# Altium project Bluetooth_Speaker_Driver.PrjPcb (part 1 of 2)
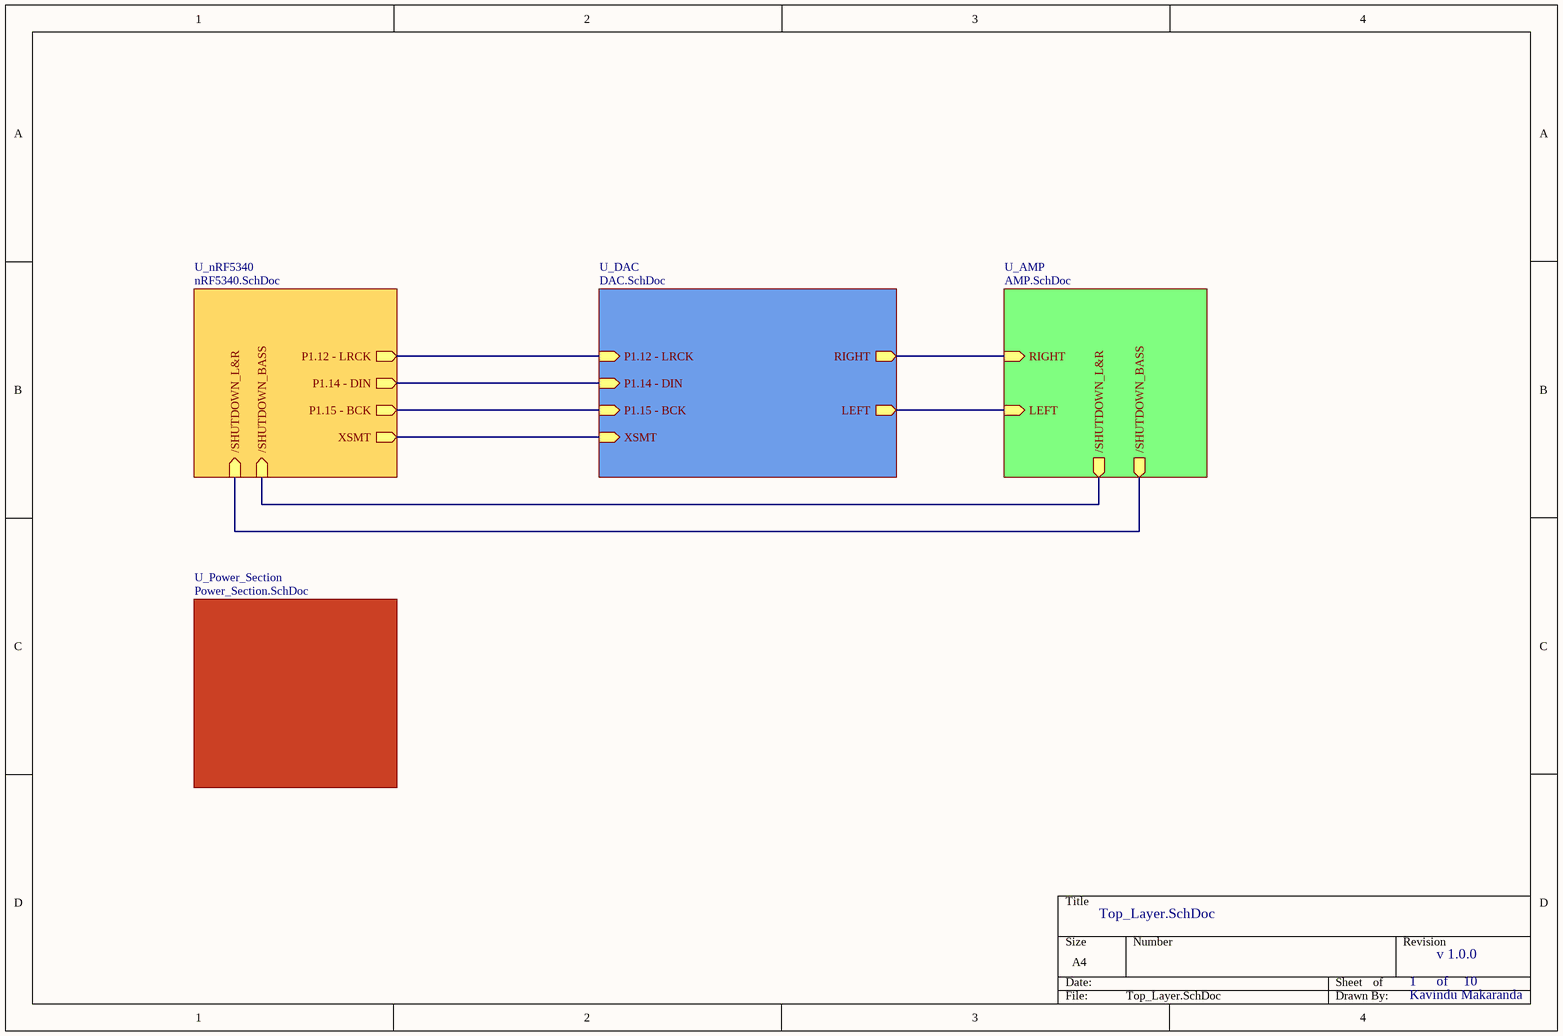
[diagram p0: Top_Layer.SchDoc]
Engineer: Kavindu Makaranda
10 sheets, 229 parts. Net scope: hierarchical (ports join the sheet entries above them; power ports are global).
Board file: PCB.PcbDoc
Sheets:
  Top_Layer.SchDoc
    U_nRF5340 = nRF5340.SchDoc
      U_LED_Indicator_? = LED_Indicator.SchDoc
      U_LED_Indicator_? = LED_Indicator.SchDoc
      U_LED_Indicator_? = LED_Indicator.SchDoc
      U_LED_Indicator_? = LED_Indicator.SchDoc
    U_Power_Section = Power_Section.SchDoc
      U_5v negative and positive channels = 5v negative and positive channels.SchDoc
    U_AMP = AMP.SchDoc
      U_Power_amp_Stereo_L&R = Stereo_L&R_TPA3138D2.SchDoc
      U_Power_amp_Bass = Mono_Bass_TPA3138D2.SchDoc
      U_LOW_PASS_FILTER = 4th_Order_Linwitz-Riley_Low_Pass_Filter.SchDoc
    U_DAC = DAC.SchDoc

## Sheet Top_Layer.SchDoc
size A4; SheetNumber: 1; SheetTotal: 10

### Sub-sheets
U_AMP = AMP.SchDoc: RIGHT (in), LEFT (in), /SHUTDOWN_L&R (out), /SHUTDOWN_BASS (out)
U_DAC = DAC.SchDoc: P1.15 - BCK (in), P1.14 - DIN (in), P1.12 - LRCK (in), LEFT (out), RIGHT (out), XSMT (in)
U_nRF5340 = nRF5340.SchDoc: P1.12 - LRCK (out), P1.14 - DIN (out), P1.15 - BCK (out), XSMT (out), /SHUTDOWN_L&R (in), /SHUTDOWN_BASS (in)
U_Power_Section = Power_Section.SchDoc: no entries

### Nets
P0.00 / XL1: sheet U_nRF5340/P1.12 - LRCK, sheet U_DAC/P1.12 - LRCK
P0.01 / XL2: sheet U_nRF5340/P1.15 - BCK, sheet U_DAC/P1.15 - BCK
P0.04 / AIN0: sheet U_nRF5340//SHUTDOWN_BASS, sheet U_AMP//SHUTDOWN_L&R
P0.05 / AIN1: sheet U_nRF5340//SHUTDOWN_L&R, sheet U_AMP//SHUTDOWN_BASS
P1.00: sheet U_nRF5340/XSMT, sheet U_DAC/XSMT
P1.01: sheet U_nRF5340/P1.14 - DIN, sheet U_DAC/P1.14 - DIN
NetC22_2: sheet U_AMP/RIGHT, sheet U_DAC/RIGHT
NetC29_2: sheet U_AMP/LEFT, sheet U_DAC/LEFT

### Notes on the sheet
- v 1.0.0
- of

## Sheet nRF5340.SchDoc
size A4; SheetNumber: 2; SheetTotal: 10
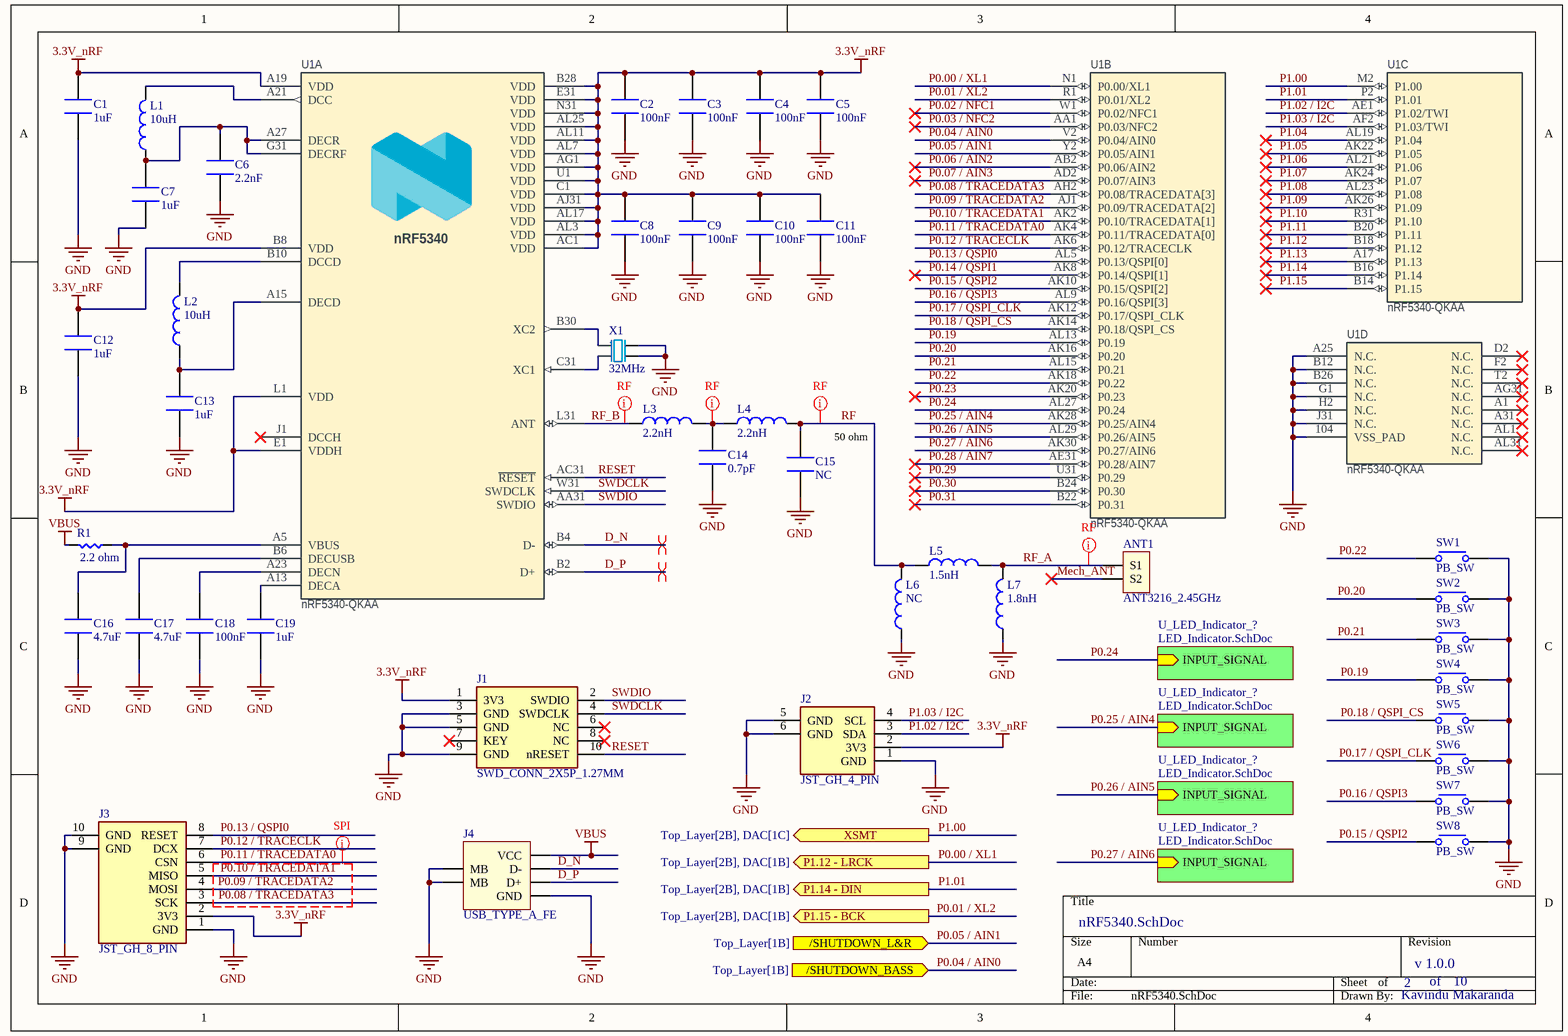
[diagram p1: nRF5340.SchDoc]

### Parts
ANT1  ANT3216_2.45GHz  [ANT3216_2.4GHz]
C1  1uF  [CAPC0402X06N]
C2  100nF  [CAPC0201X03N]
C3  100nF  [CAPC0201X03N]
C4  100nF  [CAPC0201X03N]
C5  100nF  [CAPC0201X03N]
C6  2.2nF  [CAPC0201X03N]
C7  1uF  [CAPC0402X06N]
C8  100nF  [CAPC0201X03N]
C9  100nF  [CAPC0201X03N]
C10  100nF  [CAPC0201X03N]
C11  100nF  [CAPC0201X03N]
C12  1uF  [CAPC0402X06N]
C13  1uF  [CAPC0402X06N]
C14  0.7pF  [CAPC0201X03N]
C15  NC  [CAPC0201X03N]
C16  4.7uF  [CAP0805X13N]
C17  4.7uF  [CAP0805X13N]
C18  100nF  [CAPC0201X03N]
C19  1uF  [CAPC0402X06N]
J1  SWD_CONN_2X5P_1.27MM  [CONN_2X5P_1.27MM - duplicate]
J2  JST_GH_4_PIN  [JST_GH_4_PIN]
J3  JST_GH_8_PIN  [JST_GH_8_PIN]
J4  USB_TYPE_A_FE  [USB_TYPE_A_FE]
L1  10uH  [INDC0603X08N]
L2  10uH  [INDC0603X08N]
L3  2.2nH  [INDC0201]
L4  2.2nH  [INDC0201]
L5  1.5nH  [INDC0201]
L6  NC  [INDC0201]  (no BOM)
L7  1.8nH  [INDC0201]
R1  2.2 ohm  [CAPC0201X03N]
SW1  PB_SW  [SW_PB_2]
SW2  PB_SW  [SW_PB_2]
SW3  PB_SW  [SW_PB_2]
SW4  PB_SW  [SW_PB_2]
SW5  PB_SW  [SW_PB_2]
SW6  PB_SW  [SW_PB_2]
SW7  PB_SW  [SW_PB_2]
SW8  PB_SW  [SW_PB_2]
U1  nRF5340-QKAA  [AQFN40P700X700X85_HS-99N]  (parts A,B,C,D of 4)
X1  32MHz  [CRYOSC_3.2X2.5M]

### Sub-sheets
U_LED_Indicator_? = LED_Indicator.SchDoc: INPUT_SIGNAL (in)
U_LED_Indicator_? = LED_Indicator.SchDoc: INPUT_SIGNAL (in)
U_LED_Indicator_? = LED_Indicator.SchDoc: INPUT_SIGNAL (in)
U_LED_Indicator_? = LED_Indicator.SchDoc: INPUT_SIGNAL (in)

### Ports
/SHUTDOWN_BASS (in, see Top_Layer[1B]), /SHUTDOWN_L&R (in, see Top_Layer[1B]), P1.12 - LRCK (out, see Top_Layer[2B], DAC[1B]), P1.14 - DIN (out, see Top_Layer[2B], DAC[1B]), P1.15 - BCK (out, see Top_Layer[2B], DAC[1B]), XSMT (out, see Top_Layer[2B], DAC[1C])

### Nets
3.3V_nRF: C1.2 C2.2 C3.2 C4.2 C5.2 C8.2 C9.2 C10.2 C11.2 C12.2 J1.1(3V3) J2.2(3V3) J3.2(3V3) U1.A19(VDD) U1.AC1(VDD) U1.AG1(VDD) U1.AJ31(VDD) U1.AL3(VDD) U1.AL7(VDD) U1.AL11(VDD) U1.AL17(VDD) U1.AL25(VDD) U1.B8(VDD) U1.B28(VDD) U1.C1(VDD) U1.E1(VDDH) U1.E31(VDD) U1.L1(VDD) U1.N31(VDD) U1.U1(VDD)
GND: C1.1 C2.1 C3.1 C4.1 C5.1 C6.1 C7.1 C8.1 C9.1 C10.1 C11.1 C12.1 C13.1 C14.2 C15.2 C16.1 C17.1 C18.1 C19.1 J1.3(GND) J1.5(GND) J1.9(GND) J2.1(GND) J2.5(GND) J2.6(GND) J3.1(GND) J3.9(GND) J3.10(GND) J4.4(GND) J4.5(MB) J4.6(MB) L6.1 L7.1 SW1.2 SW2.2 SW3.2 SW4.2 SW5.2 SW6.2 SW7.2 SW8.2 U1.104(VSS_PAD) U1.A25(N.C.) U1.B12(N.C.) U1.B26(N.C.) U1.G1(N.C.) U1.H2(N.C.) U1.J31(N.C.) X1.2(GND1) X1.4(GND2)
VBUS: J4.1(VCC) R1.2
D_N: J4.2(D-) U1.B4(D-)
D_P: J4.3(D+) U1.B2(D+)
Mech_ANT: ANT1.2(S2)
P0.00 / XL1: U1.N1(P0.00/XL1) ; port P1.12 - LRCK
P0.01 / XL2: U1.R1(P0.01/XL2) ; port P1.15 - BCK
P0.02 / NFC1: U1.W1(P0.02/NFC1)
P0.03 / NFC2: U1.AA1(P0.03/NFC2)
P0.04 / AIN0: U1.V2(P0.04/AIN0) ; port /SHUTDOWN_BASS
P0.05 / AIN1: U1.Y2(P0.05/AIN1) ; port /SHUTDOWN_L&R
P0.06 / AIN2: U1.AB2(P0.06/AIN2)
P0.07 / AIN3: U1.AD2(P0.07/AIN3)
P0.08 / TRACEDATA3: J3.3(SCK) U1.AH2(P0.08/TRACEDATA[3])
P0.09 / TRACEDATA2: J3.4(MOSI) U1.AJ1(P0.09/TRACEDATA[2])
P0.10 / TRACEDATA1: J3.5(MISO) U1.AK2(P0.10/TRACEDATA[1])
P0.11 / TRACEDATA0: J3.6(CSN) U1.AK4(P0.11/TRACEDATA[0])
P0.12 / TRACECLK: J3.7(DCX) U1.AK6(P0.12/TRACECLK)
P0.13 / QSPI0: J3.8(RESET) U1.AL5(P0.13/QSPI[0])
P0.14 / QSPI1: U1.AK8(P0.14/QSPI[1])
P0.15 / QSPI2: SW8.1 U1.AK10(P0.15/QSPI[2])
P0.16 / QSPI3: SW7.1 U1.AL9(P0.16/QSPI[3])
P0.17 / QSPI_CLK: SW6.1 U1.AK12(P0.17/QSPI_CLK)
P0.18 / QSPI_CS: SW5.1 U1.AK14(P0.18/QSPI_CS)
P0.19: SW4.1 U1.AL13(P0.19)
P0.20: SW2.1 U1.AK16(P0.20)
P0.21: SW3.1 U1.AL15(P0.21)
P0.22: SW1.1 U1.AK18(P0.22)
P0.23: U1.AK20(P0.23)
P0.24: U1.AL27(P0.24) ; sheet U_LED_Indicator_?/INPUT_SIGNAL
P0.25 / AIN4: U1.AK28(P0.25/AIN4) ; sheet U_LED_Indicator_?/INPUT_SIGNAL
P0.26 / AIN5: U1.AL29(P0.26/AIN5) ; sheet U_LED_Indicator_?/INPUT_SIGNAL
P0.27 / AIN6: U1.AK30(P0.27/AIN6) ; sheet U_LED_Indicator_?/INPUT_SIGNAL
P0.28 / AIN7: U1.AE31(P0.28/AIN7)
P0.29: U1.U31(P0.29)
P0.30: U1.B24(P0.30)
P0.31: U1.B22(P0.31)
P1.00: U1.M2(P1.00) ; port XSMT
P1.01: U1.P2(P1.01) ; port P1.14 - DIN
P1.02 / I2C: J2.3(SDA) U1.AE1(P1.02/TWI)
P1.03 / I2C: J2.4(SCL) U1.AF2(P1.03/TWI)
P1.04: U1.AL19(P1.04)
P1.05: U1.AK22(P1.05)
P1.06: U1.AL21(P1.06)
P1.07: U1.AK24(P1.07)
P1.08: U1.AL23(P1.08)
P1.09: U1.AK26(P1.09)
P1.10: U1.R31(P1.10)
P1.11: U1.B20(P1.11)
P1.12: U1.B18(P1.12)
P1.13: U1.A17(P1.13)
P1.14: U1.B16(P1.14)
P1.15: U1.B14(P1.15)
RESET: J1.10(nRESET) U1.AC31(~{RESET})
RF: C15.1 L4.2 L5.1 L6.2
RF_A: ANT1.1(S1) L5.2 L7.2
RF_B: L3.1 U1.L31(ANT)
SWDCLK: J1.4(SWDCLK) U1.W31(SWDCLK)
SWDIO: J1.2(SWDIO) U1.AA31(SWDIO)
NetC6_2: C6.2 C7.2 L1.1 U1.A27(DECR) U1.G31(DECRF)
NetC13_2: C13.2 L2.1 U1.A15(DECD)
NetC14_1: C14.1 L3.2 L4.1
NetC16_2: C16.2 R1.1 U1.A5(VBUS)
NetC17_2: C17.2 U1.B6(DECUSB)
NetC18_2: C18.2 U1.A23(DECN)
NetC19_2: C19.2 U1.A13(DECA)
NetL1_2: L1.2 U1.A21(DCC)
NetL2_2: L2.2 U1.B10(DCCD)
NetU1_B30: U1.B30(XC2) X1.1(CLK1)
NetU1_C31: U1.C31(XC1) X1.3(CLK2)

Not connected (* = marked no-connect by the designer): J1 6(NC)* 7(KEY)* 8(NC)*; U1 A1(N.C.)* A31(N.C.)* AG31(N.C.)* AL1(N.C.)* AL31(N.C.)* D2(N.C.)* F2(N.C.)* J1(DCCH)* T2(N.C.)*

### Layout directives
differential pair: D_N, D_P
net class RF: NetC14_1, RF, RF_A, RF_B
net class SPI: P0.08 / TRACEDATA3, P0.09 / TRACEDATA2, P0.10 / TRACEDATA1

### Notes on the sheet
- 50 ohm
- v 1.0.0
- of
- (in symbol nRF5340-QKAA, part A) nRF5340

### Library data of the parts
ANT1 = ANT3216_2.45GHz: C293767, ANT3216LL00R2400A, -40℃~+105℃ 1.2mm 1.6mm 160MHz 1W 2.45GHz 3.2mm 5.05dBi 50Ω 1206 Antennas ROHS; Supplier 1: Verical; Supplier Part Number 1: ANT3216LL00R2400A
C1 C7 C12 C13 C19 = CC0402_1uF_X7R: C307427, CL05B105KQ5NQNC, 1uF 6.3V X7R ±10% 0402 Multilayer Ceramic Capacitors MLCC - SMD/SMT ROHS; Supplier 1: element14 APAC; Supplier Part Number 1: CL05B105KQ5NQNC
C2-C5 C8-C11 C18 = CC0201_100nF_X7R: C1882920, CC0201KRX7R5BB104, 100nF 6.3V X7R ±10% 0201 Multilayer Ceramic Capacitors MLCC - SMD/SMT ROHS; Supplier 1: element14 APAC; Supplier Part Number 1: CC0201KRX7R5BB104
C6 = CC0201_2.2nF_X7R: C161488. GRM033R71E222KA12D, 2.2nF 25V X7R ±10% 0201 Multilayer Ceramic Capacitors MLCC - SMD/SMT ROHS; Supplier 1: element14 APAC; Supplier Part Number 1: GRM033R71E222KA12D
C14 C15 = CC0201_0.7pF_COG: C907945, GJM0335C1ER70WB01D, 0.7pF 25V C0G 0201 Multilayer Ceramic Capacitors MLCC - SMD/SMT ROHS; Supplier 1: element14 APAC; Supplier Part Number 1: GJM0335C1ER70WB01D
C16 C17 = CC0805_4.7uF_X7R: C354262, CC0805KKX7R8BB475, 25V 4.7uF X7R ±10% 0805 Multilayer Ceramic Capacitors MLCC - SMD/SMT ROHS; Supplier 1: element14 APAC; Supplier Part Number 1: CC0805KKX7R8BB475
J1 = SWD_CONN_2X5P_1.27MM: C42372547, HX JN1.27-2x5P ZZ H4.9, -40℃~+105℃ 1.27mm 1.27mm 1A 2 2x5P 5 500V Black Copper Gold IDC Header Through Hole Plugin,P=1.27mm IDC Connectors ROHS; Supplier 1: Verical; Supplier Part Number 1: 3220-10-0100-00
J2 = JST_GH_4_PIN: C161692, BM04B-GHS-TBT(LF)(SN), -25℃~+85℃ 1 1.25mm 1A 1x4P 4 4.05mm 4.32mm 4P 50V 8.25mm Auxiliary Solder Pin GH PA9T Phosphor bronze Surface Mount,Vertical Tin UL94V-0 White SMD,P=1.25mm Wire To Board Connector ROHS; Supplier 1: CoreStaff; Supplier Part Number 1: ST74986991
J3 = JST_GH_8_PIN: C133062, BM08B-GHS-TBT(LF)(SN), -25℃~+85℃ 1 1.25mm 13.25mm 1A 1x8P 4.05mm 4.32mm 50V 8 8P Auxiliary Solder Pin GH PA9T Phosphor bronze Surface Mount,Vertical Tin UL94V-0 White SMD,P=1.25mm Wire To Board Connector ROHS; Supplier 1: Future Electronics; Supplier Part Number 1: BM08B-GHS-TBT(LF)(SN)
J4 = USB_TYPE_A_FE: C456018, AF 90 WJDG, -25℃~+85℃ 1 1.5A 14mm 30V 4P 5,000 times Female Right Angle Type-A USB 2.0 White 弯插 USB Connectors ROHS; Supplier 1: UnikeyIC; Supplier Part Number 1: AF 90 WJDG
L1 L2 = IN0603_10uH: C76798, MLZ1608M100WT000, 1.05Ω 10uH 250mA 2MHz 90mA Multilayer inductor ±20% 0603 Inductors (SMD) ROHS; Supplier 1: element14 APAC; Supplier Part Number 1: MLZ1608M100WT000
L3 L4 = IN0201_2.2nH: C98041, LQP03TN2N2B02D, 11GHz 14@500MHz 150mΩ 2.2nH 600mA Thick Film Inductor 0201 Inductors (SMD) ROHS; Supplier 1: element14 APAC; Supplier Part Number 1: LQP03TN2N2B02D
L5 = IN0201_1.5nH: C77114, LQP03TN1N5B02D, 1.5nH 14@500MHz 150mΩ 15GHz 600mA Thick Film Inductor 0201 Inductors (SMD) ROHS; Supplier 1: Future Electronics; Supplier Part Number 1: LQP03TN1N5B02D
L6 L7 = IN0201_1.8nH: C98040, LQP03TN1N8B02D, 1.8nH 14@500MHz 150mΩ 15GHz 600mA Thick Film Inductor 0201 Inductors (SMD) ROHS; Supplier 1: element14 APAC; Supplier Part Number 1: LQP03TN1N8B02D
R1 = REC0201_2.2_THICK: C474415, RC0201JR-072R2L, -100ppm/℃~+350ppm/℃ -55℃~+125℃ 2.2Ω 25V 50mW Thick Film Resistor ±5% 0201 Chip Resistor - Surface Mount ROHS; Supplier 1: element14 APAC; Supplier Part Number 1: RC0201JR-072R2L
SW1-SW8 = SW_SMD_PUSH: C49393629, R4A25211L, 1.8N 12V 50mA Gull Wing Rectangular Button SPST-NO Surface Mount,Vertical White SMD Pushbutton Switches ROHS
U1 = nRF5340-QKAA: Multi-protocol Bluetooth Low Energy, IEEE 802.15.4, ANT and 2.4GHz proprietary system-on-chip; Pad Count: 98; Footprint Doc: AQFN-98; Value: nRF5340-QKAA; Component Class: nRF_Devices; Supplier 1: DigiKey; Supplier Part Number 1: 4823-NRF5340-QKAA-RCT-ND; Supplier 2: DigiKey; Supplier Part Number 2: 4823-NRF5340-QKAA-R7CT-ND
X1 = SMD3225_4P_32MHz_OSC: C20617581, XL2MI-111-32M, -40℃~+85℃ 10pF 32MHz 40Ω Crystal Oscillator ±10ppm ±20ppm SMD3225-4P Crystals ROHS; Supplier 1: UnikeyIC; Supplier Part Number 1: XL2MI-111-32M

## Sheet LED_Indicator.SchDoc
size A4; SheetNumber: 3; SheetTotal: 10
Used 4 times, as channels U_nRF5340/U_LED_Indicator_?, U_nRF5340/U_LED_Indicator_?, U_nRF5340/U_LED_Indicator_?, U_nRF5340/U_LED_Indicator_?. Parts and nets are listed once, with the designators drawn on the sheet.
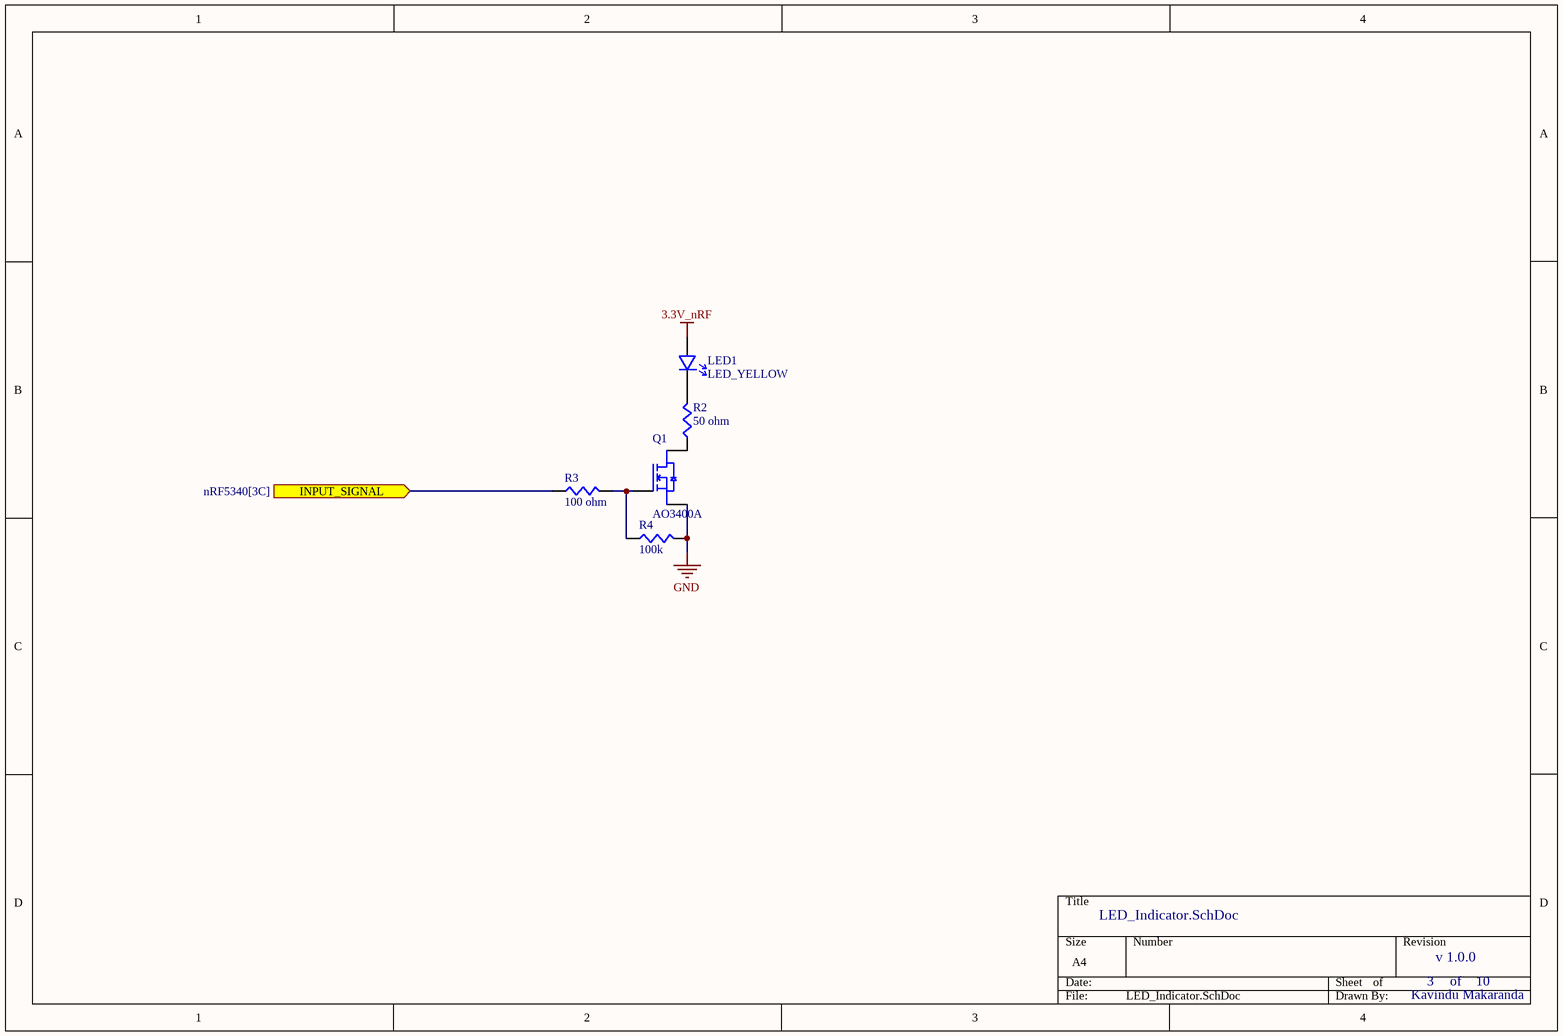
[diagram p2: LED_Indicator.SchDoc]

### Parts
LED1  LED_YELLOW  [LED_0805_127P120X200-2N]
Q1  AO3400A  [SOT23_P240X110-3N]
R2  50 ohm  [RECS0603X45N]
R3  100 ohm  [RECS0603X45N]
R4  100k  [RECS0603X45N]

### Ports
INPUT_SIGNAL (in, see nRF5340[3C])

### Nets
3.3V_nRF: LED1.2(+)
GND: Q1.2(SOURCE) R4.2
INPUT_SIGNAL: R3.1 ; port INPUT_SIGNAL
NetLED1_1: LED1.1(-) R2.2
NetQ1_1: Q1.1(GATE) R3.2 R4.1
NetQ1_3: Q1.3(DRAIN) R2.1

### Channels
U_nRF5340/U_LED_Indicator_?: designators end in D; ports INPUT_SIGNAL=P0.24
U_nRF5340/U_LED_Indicator_?: designators end in C; ports INPUT_SIGNAL=P0.26 / AIN5
U_nRF5340/U_LED_Indicator_?: designators end in B; ports INPUT_SIGNAL=P0.25 / AIN4
U_nRF5340/U_LED_Indicator_?: designators end in A; ports INPUT_SIGNAL=P0.27 / AIN6

### Notes on the sheet
- v 1.0.0
- of

### Library data of the parts
LED1 = LED0805_YELLOW: C965814, XL-2012UYC, 120° 2.3V 20mA 50mW 585nm~595nm 590nm Discrete Diode Top-mount Water Clear Yellow 0805 LED Indication - Discrete ROHS; Supplier 1: UnikeyIC; Supplier Part Number 1: XL-2012UYC
Q1 = SOT_23_AO3400A: C347475, AO3400A, -55℃~+150℃ 1 N-channel 1.1V 1.4W 17mΩ@10V 30V 5.8A 77pF 823pF 9.7nC@4.5V 99pF SOT-23 MOSFETs ROHS; Supplier 1: UnikeyIC; Supplier Part Number 1: AO3400A
R2 = RESC0603_50_THIN: C849792, RT0603BRE0750RL, -55℃~+155℃ 100mW 50Ω 75V Thin Film Resistor ±0.1% ±50ppm/℃ 0603 Chip Resistor - Surface Mount ROHS; Supplier 1: element14 APAC; Supplier Part Number 1: RT0603BRE0750RL
R3 = RESC0603_100_THIN: C122970, RT0603BRD07100RL, -55℃~+155℃ 100mW 100Ω 75V Thin Film Resistor ±0.1% ±25ppm/℃ 0603 Chip Resistor - Surface Mount ROHS; Supplier 1: element14 APAC; Supplier Part Number 1: RT0603BRD07100RL
R4 = RESC0603_100K_THIN: C116674, AC0603FR-07100KL, -55℃~+155℃ 100kΩ 100mW 75V Thick Film Resistor ±1% ±100ppm/℃ 0603 Chip Resistor - Surface Mount ROHS; Supplier 1: element14 APAC; Supplier Part Number 1: AC0603FR-07100KL

## Sheet Power_Section.SchDoc
size A4; SheetNumber: 5; SheetTotal: 10
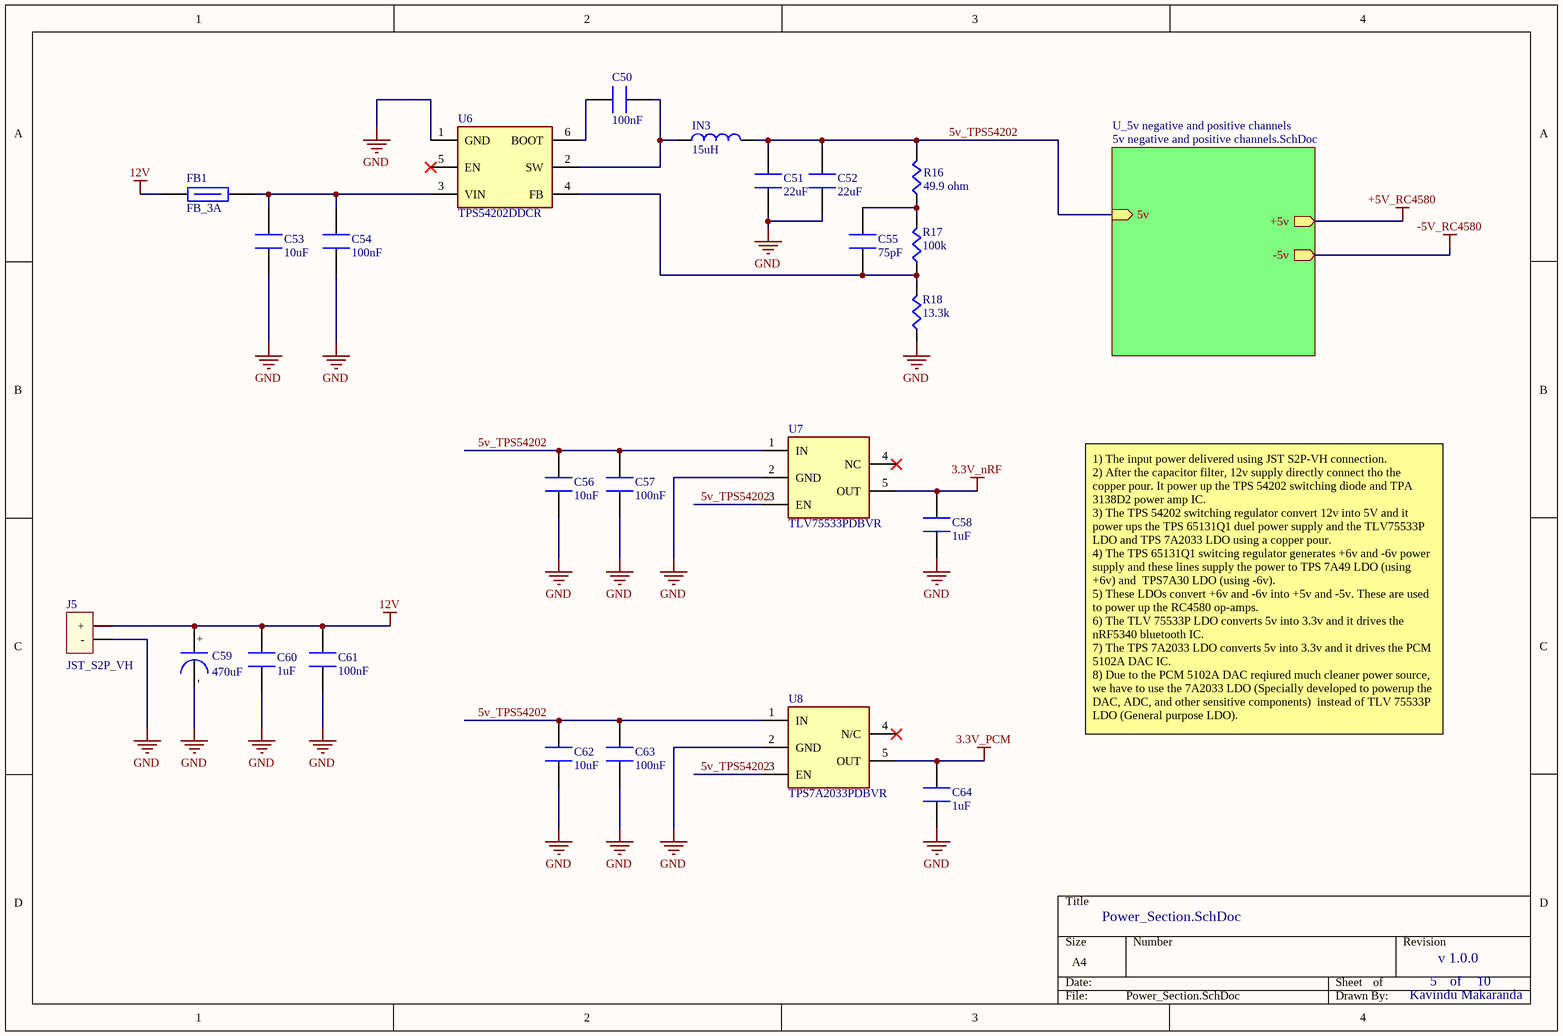
[diagram p3: Power_Section.SchDoc]

### Parts
C50  100nF  [CAPC0603X8N]
C51  22uF  [CAPC1210X25N]
C52  22uF  [CAPC1210X25N]
C53  10uF  [CAPC0805X14N]
C54  100nF  [CAPC0603X8N]
C55  75pF  [CAPC0603X8N]
C56  10uF  [CAPC0805X14N]
C57  100nF  [CAPC0603X8N]
C58  1uF  [CAP0805X13N]
C59  470uF  [CAPD10XL11.1X10.2M]
C60  1uF  [CAP0805X13N]
C61  100nF  [CAPC0603X8N]
C62  10uF  [CAPC0805X14N]
C63  100nF  [CAPC0603X8N]
C64  1uF  [CAP0805X13N]
FB1  FB_3A  [FB0603X08N]
IN3  15uH  [INDM7266X30N]
J5  JST_S2P_VH  [JST_S2P_VH]
R16  49.9 ohm  [RECS0603X45N]
R17  100k  [RECS0603X45N]
R18  13.3k  [RECS0603X45N]
U6  TPS54202DDCR  [TPS54202DDCR]
U7  TLV75533PDBVR  [SOT95P280X145-5N]
U8  TPS7A2033PDBVR  [SOT95P280X145-5N]

### Sub-sheets
U_5v negative and positive channels = 5v negative and positive channels.SchDoc: +5v (out), -5v (out), 5v (in)

### Nets
3.3V_nRF: C58.2 U7.5(OUT)
3.3V_PCM: C64.2 U8.5(OUT)
12V: C59.1 C60.2 C61.2 FB1.1 J5.1(+)
GND: C51.1 C52.1 C53.1 C54.1 C56.1 C57.1 C58.1 C59.2 C60.1 C61.1 C62.1 C63.1 C64.1 J5.2(-) R18.1 U6.1(GND) U7.2(GND) U8.2(GND)
5v_TPS54202: C51.2 C52.2 C56.2 C57.2 C62.2 C63.2 IN3.2 R16.2 U7.1(IN) U7.3(EN) U8.1(IN) U8.3(EN) ; sheet U_5v negative and positive channels/5v
NetC50_1: C50.1 IN3.1 U6.2(SW)
NetC50_2: C50.2 U6.6(BOOT)
NetC53_2: C53.2 C54.2 FB1.2 U6.3(VIN)
NetC55_1: C55.1 R17.1 R18.2 U6.4(FB)
NetC55_2: C55.2 R16.1 R17.2

Not connected (* = marked no-connect by the designer): U6 5(EN)*; U7 4(NC)*; U8 4(N/C)*

### Notes on the sheet
- 1) The input power delivered using JST S2P-VH connection.
  2) After the capacitor filter, 12v supply directly connect tho the copper pour. It power up the TPS 54202 switching diode and TPA 3138D2 power amp IC.
  3) The TPS 54202 switching regulator convert 12v into 5V and it power ups the TPS 65131Q1 duel power supply and the TLV75533P LDO and TPS 7A2033 LDO using a copper pour.
  4) The TPS 65131Q1 switcing regulator generates +6v and -6v power supply and these lines supply the power to TPS 7A49 LDO (using +6v) and  TPS7A30 LDO (using -6v).
  5) These LDOs convert +6v and -6v into +5v and -5v. These are used to power up the RC4580 op-amps.
  6) The TLV 75533P LDO converts 5v into 3.3v and it drives the nRF5340 bluetooth IC.
  7) The TPS 7A2033 LDO converts 5v into 3.3v and it drives the PCM 5102A DAC IC.
  8) Due to the PCM 5102A DAC reqiured much cleaner power source, we have to use the 7A2033 LDO (Specially developed to powerup the DAC, ADC, and other sensitive components)  instead of TLV 75533P LDO (General purpose LDO).
- v 1.0.0
- of
- (in symbol CPD10XL10.2_470uF_ALUM) +; -

### Library data of the parts
C50 C54 C57 C61 C63 = CC0603_100nF_X7R: C14663, CC0603KRX7R9BB104, 100nF 50V X7R ±10% 0603 Multilayer Ceramic Capacitors MLCC - SMD/SMT ROHS; Supplier 1: element14 APAC; Supplier Part Number 1: CC0603KRX7R9BB104
C51 C52 = CC1210_22uF_X7R: C309062, CL32B226KAJNNNE, 22uF 25V X7R ±10% 1210 Multilayer Ceramic Capacitors MLCC - SMD/SMT ROHS; Supplier 1: Avnet; Supplier Part Number 1: CL32B226KAJNNNE
C53 C56 C62 = CC0805_10uF_X7R: C95841, CL21B106KOQNNNE, 10uF 16V X7R ±10% 0805 Multilayer Ceramic Capacitors MLCC - SMD/SMT ROHS; Supplier 1: Avnet; Supplier Part Number 1: CL21B106KOQNNNE
C55 = CC0603_75pF_NPO: C282074, CC0603JRNPO9BN750, 50V 75pF NP0 ±5% 0603 Multilayer Ceramic Capacitors MLCC - SMD/SMT ROHS; Supplier 1: element14 APAC; Supplier Part Number 1: CC0603JRNPO9BN750
C58 C60 C64 = CC0805_1uF_X7R: C28323, CL21B105KBFNNNE, 1uF 50V X7R ±10% 0805 Multilayer Ceramic Capacitors MLCC - SMD/SMT ROHS; Supplier 1: Future Electronics; Supplier Part Number 1: CL21B105KBFNNNE
C59 = CPD10XL10.2_470uF_ALUM: C3350, RVT1V471M1010, -55℃~+105℃ 10.2mm 10mm 2000hrs@105℃ 35V 470uF ±20% SMD,D10xL10.2mm Aluminum Electrolytic Capacitors - SMD ROHS; Supplier 1: UnikeyIC; Supplier Part Number 1: RVT1V471M1010
FB1 = FB0603_3A: C107332, MPZ1608S101ATAH0, -55℃~+125℃ 1 100Ω@100MHz 30mΩ 3A ±25% 0603 Ferrite Beads ROHS; Supplier 1: element14 APAC; Supplier Part Number 1: MPZ1608S101ATAH0
IN3 = IN7266_15uH_3A: C5189959, CYA0630-15UH, 15uH 3.8A 3A 98mΩ ±20% SMD,7.2x6.6mm Inductors (SMD) ROHS; Supplier 1: LCSC; Supplier Part Number 1: C5189959
J5 = JST_S2P_VH: C160355, S2P-VH(LF)(SN), -25℃~+85℃ 1 10A 13.9mm 1x2P 2 250V 2P 3.96mm 7.86mm Brass PA66 Right Angle Tin UL94V-0 VH White 弯插,P=3.96mm Wire To Board Connector ROHS; Supplier 1: CoreStaff; Supplier Part Number 1: ST73514420
R16 = RESC0603_49.9_THIN: C23185, 0603WAF499JT5E, -55℃~+155℃ 100mW 49.9Ω 75V Thick Film Resistor ±1% ±100ppm/℃ 0603 Chip Resistor - Surface Mount ROHS; Supplier 1: TME; Supplier Part Number 1: 0603WAF499JT5E
R17 = RESC0603_100K_THIN: as R4 on sheet LED_Indicator; Supplier 1: element14 APAC; Supplier Part Number 1: AC0603FR-07100KL
R18 = REC0603_13.3K_THICK: C185373, RC0603FR-0713K3L, -55℃~+155℃ 100mW 13.3kΩ 75V Thick Film Resistor ±1% ±100ppm/℃ 0603 Chip Resistor - Surface Mount ROHS; Supplier 1: Future Electronics; Supplier Part Number 1: RC0603FR-0713K3L
U6 = TPS54202DDCR: C191884, TPS54202DDCR, -40℃~+125℃@(TJ) 1 2A 4.5V~28V 45uA 500kHz Adjustable Buck Buck Built-in Yes SOT-23-6 DC-DC Converters ROHS; Manufacturer_Name: Texas Instruments; Datasheet Link: http://www.ti.com/lit/gpn/tps54202; Height: 1.1mm; Manufacturer_Part_Number: TPS54202DDCR; Mouser Part Number: 595-TPS54202DDCR; Mouser Price/Stock: https://www.mouser.co.uk/ProductDetail/Texas-Instruments/TPS54202DDCR?qs=uP22XH7NdCsJtN%2Fq54jCtQ%3D%3D; Arrow Part Number: TPS54202DDCR; Arrow Price/Stock: https://www.arrow.com/en/products/tps54202ddcr/texas-instruments?utm_currency=USD&region=nac; Supplier 1: DigiKey; Supplier Part Number 1: 296-TPS54202DDCRCT-ND
U7 = TLV75533PDBVR: C404027, TLV75533PDBVR, -40℃~+125℃@(Tj) 1 238mV@(500mA) 25uA 3.3V 46dB@(100kHz) 5.5V 500mA 71.5uVrms Fixed Over Current Protection、Thermal Shutdown、Input undervoltage protection Positive SOT-23-5 Voltage Regulators - Linear, Low Drop Out (LDO) Regulators ROHS; Manufacturer_Name: Texas Instruments; Datasheet Link: http://www.ti.com/lit/gpn/tlv755p; Height: 1.45mm; Manufacturer_Part_Number: TLV75533PDBVR; Mouser Part Number: 595-TLV75533PDBVR; Mouser Price/Stock: https://www.mouser.co.uk/ProductDetail/Texas-Instruments/TLV75533PDBVR?qs=55YtniHzbhAKEwqeO2xJXQ%3D%3D; Arrow Part Number: TLV75533PDBVR; Arrow Price/Stock: https://www.arrow.com/en/products/tlv75533pdbvr/texas-instruments?utm_currency=USD&region=nac; Supplier 1: DigiKey; Supplier Part Number 1: 296-50411-1-ND
U8 = TPS7A2033PDBVR: C2862740, TPS7A2033PDBVR, -40℃~+125℃@(Tj) 1 10uVrms 140mV@(300mA) 3.3V 300mA 65dB@(100kHz) 6V 8.5uA Fixed Over Current Protection、Enable Positive SOT-23-5 Voltage Regulators - Linear, Low Drop Out (LDO) Regulators ROHS; Manufacturer_Name: Texas Instruments; Datasheet Link: https://www.ti.com/lit/ds/symlink/tps7a20.pdf?ts=1603960048570&ref_url=https%253A%252F%252Fwww.ti.com%252Fstore%252Fti%252Fen%252Fp%252Fproduct%252F%253Fp%253DPTPS7A2045PDQNR%2526keyMatch%253DPTPS7A2045PDQNR%2526tisearch%253DSearch-EN-everything; Height: 1.45mm; Manufacturer_Part_Number: TPS7A2033PDBVR; Mouser Part Number: 595-TPS7A2033PDBVR; Mouser Price/Stock: https://www.mouser.co.uk/ProductDetail/Texas-Instruments/TPS7A2033PDBVR?qs=hd1VzrDQEGjk%2FOBnRfKB4A%3D%3D; Arrow Part Number: TPS7A2033PDBVR; Arrow Price/Stock: https://www.arrow.com/en/products/tps7a2033pdbvr/texas-instruments.html?utm_currency=USD&region=nac; Supplier 1: DigiKey; Supplier Part Number 1: 296-TPS7A2033PDBVRCT-ND

## Sheet 5v negative and positive channels.SchDoc
size A4; SheetNumber: 6; SheetTotal: 10
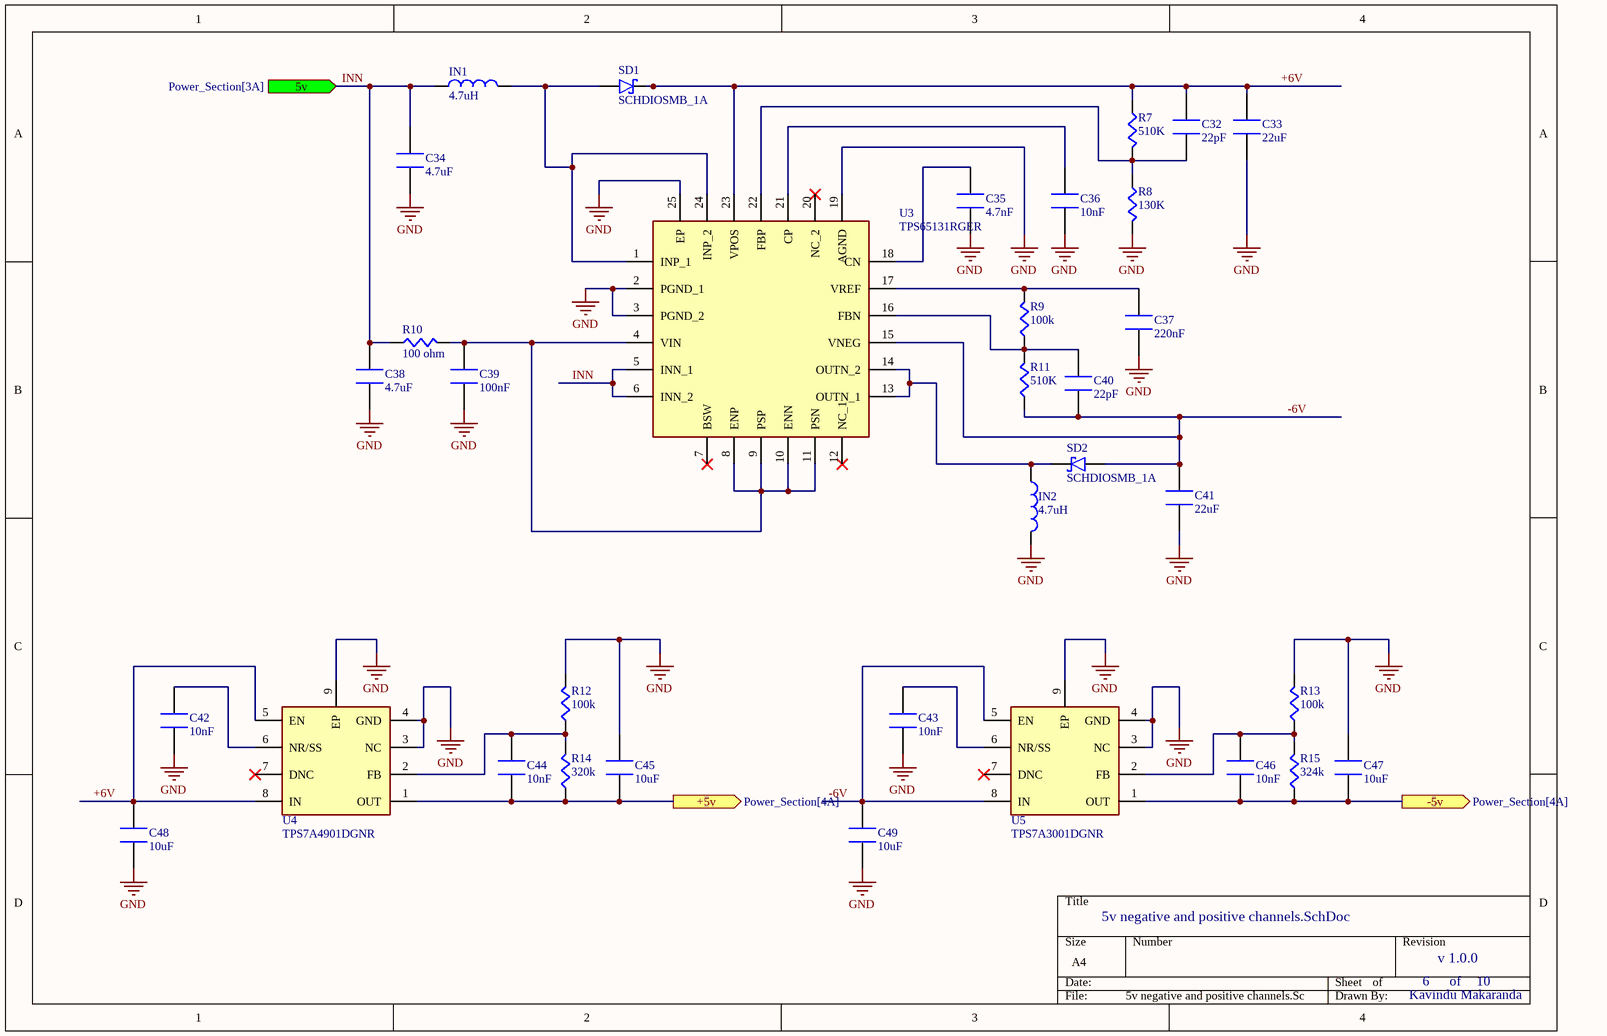
[diagram p4: 5v negative and positive channels.SchDoc]

### Parts
C32  22pF  [CAPC0603X8N]
C33  22uF  [CAPC1210X25N]
C34  4.7uF  [CAP0805X13N]
C35  4.7nF  [CAPC0603X8N]
C36  10nF  [CAPC0603X8N]
C37  220nF  [CAPC1206X18N]
C38  4.7uF  [CAP0805X13N]
C39  100nF  [CAPC0603X8N]
C40  22pF  [CAPC0603X8N]
C41  22uF  [CAPC1210X25N]
C42  10nF  [CAPC0603X8N]
C43  10nF  [CAPC0603X8N]
C44  10nF  [CAPC0603X8N]
C45  10uF  [CAPC0805X14N]
C46  10nF  [CAPC0603X8N]
C47  10uF  [CAPC0805X14N]
C48  10uF  [CAPC0805X14N]
C49  10uF  [CAPC0805X14N]
IN1  4.7uH  [INDC2520X10N]
IN2  4.7uH  [INDC2520X10N]
R7  510K  [RECS0603X45N]
R8  130K  [RECS0603X45N]
R9  100k  [RECS0603X45N]
R10  100 ohm  [RECS0603X45N]
R11  510K  [RECS0603X45N]
R12  100k  [RECS0603X45N]
R13  100k  [RECS0603X45N]
R14  320k  [RECS0603X45N]
R15  324k  [RECS0603X45N]
SD1  SCHDIOSMB_1A  [SD_SMB_1A]
SD2  SCHDIOSMB_1A  [SD_SMB_1A]
U3  TPS65131RGER  [QFN50P400X400X100-25N-D]
U4  TPS7A4901DGNR  [SOP65P490X110-9N]
U5  TPS7A3001DGNR  [SOP65P490X110-9N]

### Ports
5v (in, see Power_Section[3A]), +5v (out, see Power_Section[4A]), -5v (out, see Power_Section[4A])

### Nets
+5V_RC4580: C44.1 C45.1 R14.1 U4.1(OUT) ; port +5v
-5V_RC4580: C46.1 C47.1 R15.1 U5.1(OUT) ; port -5v
GND: C33.1 C34.1 C35.1 C36.1 C37.1 C38.1 C39.1 C41.1 C42.1 C43.1 C45.2 C47.2 C48.1 C49.1 IN2.2 R8.2 R12.2 R13.2 U3.2(PGND_1) U3.3(PGND_2) U3.19(AGND) U3.25(EP) U4.3(NC) U4.4(GND) U4.9(EP) U5.3(NC) U5.4(GND) U5.9(EP)
+6V: C32.2 C33.2 C48.2 R7.1 SD1.2 U3.23(VPOS) U4.5(EN) U4.8(IN)
-6V: C40.1 C41.2 C49.2 R11.1 SD2.1 U3.15(VNEG) U5.5(EN) U5.8(IN)
INN: C34.2 C38.2 IN1.1 R10.1 U3.5(INN_1) U3.6(INN_2) ; port 5v  [project net 5v_TPS54202]
NetC32_1: C32.1 R7.2 R8.1 U3.22(FBP)
NetC35_2: C35.2 U3.18(CN)
NetC36_2: C36.2 U3.21(CP)
NetC37_2: C37.2 R9.2 U3.17(VREF)
NetC39_2: C39.2 R10.2 U3.4(VIN) U3.8(ENP) U3.9(PSP) U3.10(ENN) U3.11(PSN)
NetC40_2: C40.2 R9.1 R11.2 U3.16(FBN)
NetC42_2: C42.2 U4.6(NR/SS)
NetC43_2: C43.2 U5.6(NR/SS)
NetC44_2: C44.2 R12.1 R14.2 U4.2(FB)
NetC46_2: C46.2 R13.1 R15.2 U5.2(FB)
NetIN1_2: IN1.2 SD1.1 U3.1(INP_1) U3.24(INP_2)
NetIN2_1: IN2.1 SD2.2 U3.13(OUTN_1) U3.14(OUTN_2)

Not connected (* = marked no-connect by the designer): U3 7(BSW)* 12(NC_1)* 20(NC_2)*; U4 7(DNC)*; U5 7(DNC)*

### Notes on the sheet
- v 1.0.0
- of

### Library data of the parts
C32 C40 = CC0603_22pF_NPO: C105620, CC0603JRNPO9BN220, 22pF 50V NP0 ±5% 0603 Multilayer Ceramic Capacitors MLCC - SMD/SMT ROHS; Supplier 1: element14 APAC; Supplier Part Number 1: CC0603JRNPO9BN220
C33 C41 = CC1210_22uF_X7R: as C51 on sheet Power_Section; Supplier 1: Avnet; Supplier Part Number 1: CL32B226KAJNNNE
C34 C38 = CC0805_4.7uF_X7R: as C16 on sheet nRF5340; Supplier 1: element14 APAC; Supplier Part Number 1: CC0805KKX7R8BB475
C35 = CC0603_4.7nF_X7R: C106218, CC0603KRX7R9BB472, 4.7nF 50V X7R ±10% 0603 Multilayer Ceramic Capacitors MLCC - SMD/SMT ROHS; Supplier 1: element14 APAC; Supplier Part Number 1: CC0603KRX7R9BB472
C36 C42-C44 C46 = CC0603_10nF_X7R: C100042, CC0603KRX7R9BB103, 10nF 50V X7R ±10% 0603 Multilayer Ceramic Capacitors MLCC - SMD/SMT ROHS; Supplier 1: element14 APAC; Supplier Part Number 1: CC0603KRX7R9BB103
C37 = CC0603_220nF_NPO: C464977, GRM31C5C1H224JE02L, 220nF 50V C0G ±5% 1206 Multilayer Ceramic Capacitors MLCC - SMD/SMT ROHS; Supplier 1: Chip One Stop; Supplier Part Number 1: GRM31C5C1H224JE02L
C39 = CC0603_100nF_X7R: as C50 on sheet Power_Section; Supplier 1: element14 APAC; Supplier Part Number 1: CC0603KRX7R9BB104
C45 C47-C49 = CC0805_10uF_X7R: as C53 on sheet Power_Section; Supplier 1: Avnet; Supplier Part Number 1: CL21B106KOQNNNE
IN1 IN2 = IN2520_4.7uH_1A: C91237, MLP2520S4R7MT0S1, 130mΩ 1A 4.7uH Multilayer inductor ±20% 1008 Inductors (SMD) ROHS; Supplier 1: element14 APAC; Supplier Part Number 1: MLP2520S4R7MT0S1
R7 R11 = RESC0603_510K_THICK: C114066, RC0603FR-07510KL, -55℃~+155℃ 100mW 510kΩ 75V Thick Film Resistor ±1% ±100ppm/℃ 0603 Chip Resistor - Surface Mount ROHS; Supplier 1: element14 APAC; Supplier Part Number 1: RC0603FR-07510KL
R8 = RESC0603_130K_THICK: C163432, RC0603FR-07130KL, -55℃~+155℃ 100mW 130kΩ 75V Thick Film Resistor ±1% ±100ppm/℃ 0603 Chip Resistor - Surface Mount ROHS; Supplier 1: element14 APAC; Supplier Part Number 1: RC0603FR-07130KL
R9 R12 R13 = RESC0603_100K_THIN: as R4 on sheet LED_Indicator; Supplier 1: element14 APAC; Supplier Part Number 1: AC0603FR-07100KL
R10 = RESC0603_100_THIN: as R3 on sheet LED_Indicator; Supplier 1: element14 APAC; Supplier Part Number 1: RT0603BRD07100RL
R14 = RESC0603_320K_THIN: C20165692, RT0603BRD07320KL, -55℃~+155℃ 100mW 320kΩ 75V Thin Film Resistor ±0.1% ±25ppm/℃ 0603 Chip Resistor - Surface Mount ROHS; Supplier 1: element14 APAC; Supplier Part Number 1: RT0603BRD07320KL
R15 = RESC0603_324K_THIN: C861321, RT0603BRD07324KL, -55℃~+155℃ 100mW 324kΩ 75V Thin Film Resistor ±0.1% ±25ppm/℃ 0603 Chip Resistor - Surface Mount ROHS; Supplier 1: Verical; Supplier Part Number 1: RT0603BRD07324KL
SD1 SD2 = SCHDIOSMB_1A: C86598, STPS160U, 1 Independent 1A 4uA@60V 60V 670mV@1A 75A SMB Schottky Diodes ROHS; Supplier 1: element14 APAC; Supplier Part Number 1: STPS160U
U3 = TPS65131RGER: C87663, TPS65131RGER, -15V~-2V、500mV~15V -40℃~+85℃@(TA)、-40℃~+125℃@(TJ) 1.25MHz~1.5MHz 1.95A 2 2.7V~5.5V 500uA Adjustable Boost、Inverting Buck-Boost Built-in No QFN-24-EP(4x4) DC-DC Converters ROHS; Manufacturer_Name: Texas Instruments; Datasheet Link: http://www.ti.com/general/docs/suppproductinfo.tsp?distId=10&gotoUrl=http%3A%2F%2Fwww.ti.com%2Flit%2Fgpn%2Ftps65130; Height: 1mm; Manufacturer_Part_Number: TPS65131RGER; Mouser Part Number: 595-TPS65131RGER; Mouser Price/Stock: https://www.mouser.co.uk/ProductDetail/Texas-Instruments/TPS65131RGER?qs=Gse6rAGbi7988IP%2FxurOIw%3D%3D; Arrow Part Number: TPS65131RGER; Arrow Price/Stock: https://www.arrow.com/en/products/tps65131rger/texas-instruments.html?utm_currency=USD&region=nac; Supplier 1: Arrow Electronics; Supplier Part Number 1: TPS65131RGER
U4 = TPS7A4901DGNR: C16430, TPS7A4901DGNR,  -40℃~+125℃@(Tj) 1 1.194V~33V 15.4uVrms 150mA 260mV@(100mA) 35V 49uA 72dB@(120Hz) Adjustable Positive Under Voltage Lockout、Over Current Protection、Over Temperature Protection、Enable HVSSOP-8 Voltage Regulators - Linear, Low Drop Out (LDO) Regulators ROHS; Manufacturer_Name: Texas Instruments; Datasheet Link: http://www.ti.com/lit/ds/sbvs121b/sbvs121b.pdf; Height: 1.1mm; Manufacturer_Part_Number: TPS7A4901DGNR; Mouser Part Number: 595-TPS7A4901DGNR; Mouser Price/Stock: https://www.mouser.co.uk/ProductDetail/Texas-Instruments/TPS7A4901DGNR?qs=Ze4%2FuFuz19J1%252B3gTImnAgQ%3D%3D; Arrow Part Number: TPS7A4901DGNR; Arrow Price/Stock: https://www.arrow.com/en/products/tps7a4901dgnr/texas-instruments?utm_currency=USD&region=europe; Supplier 1: Arrow Electronics; Supplier Part Number 1: TPS7A4901DGNR
U5 = TPS7A3001DGNR: C33835, TPS7A3001DGNR, -40℃~+125℃@(Tj) 1 1.18V~33V 15.1uVrms 200mA 216mV@(100mA) 36V 55uA 72dB@(120Hz) Adjustable Negative Over Current Protection、Enable、Thermal Shutdown HVSSOP-8 Voltage Regulators - Linear, Low Drop Out (LDO) Regulators ROHS; Manufacturer_Name: Texas Instruments; Datasheet Link: http://www.ti.com/lit/ds/symlink/tps7a30.pdf; Height: 1.1mm; Manufacturer_Part_Number: TPS7A3001DGNR; Mouser Part Number: 595-TPS7A3001DGNR; Mouser Price/Stock: https://www.mouser.co.uk/ProductDetail/Texas-Instruments/TPS7A3001DGNR?qs=Ze4%2FuFuz19IOnYFqkI4X3Q%3D%3D; Arrow Part Number: TPS7A3001DGNR; Arrow Price/Stock: https://www.arrow.com/en/products/tps7a3001dgnr/texas-instruments?region=nac; Supplier 1: Arrow Electronics; Supplier Part Number 1: TPS7A3001DGNR

## Sheet AMP.SchDoc
size A4; SheetNumber: 7; SheetTotal: 10
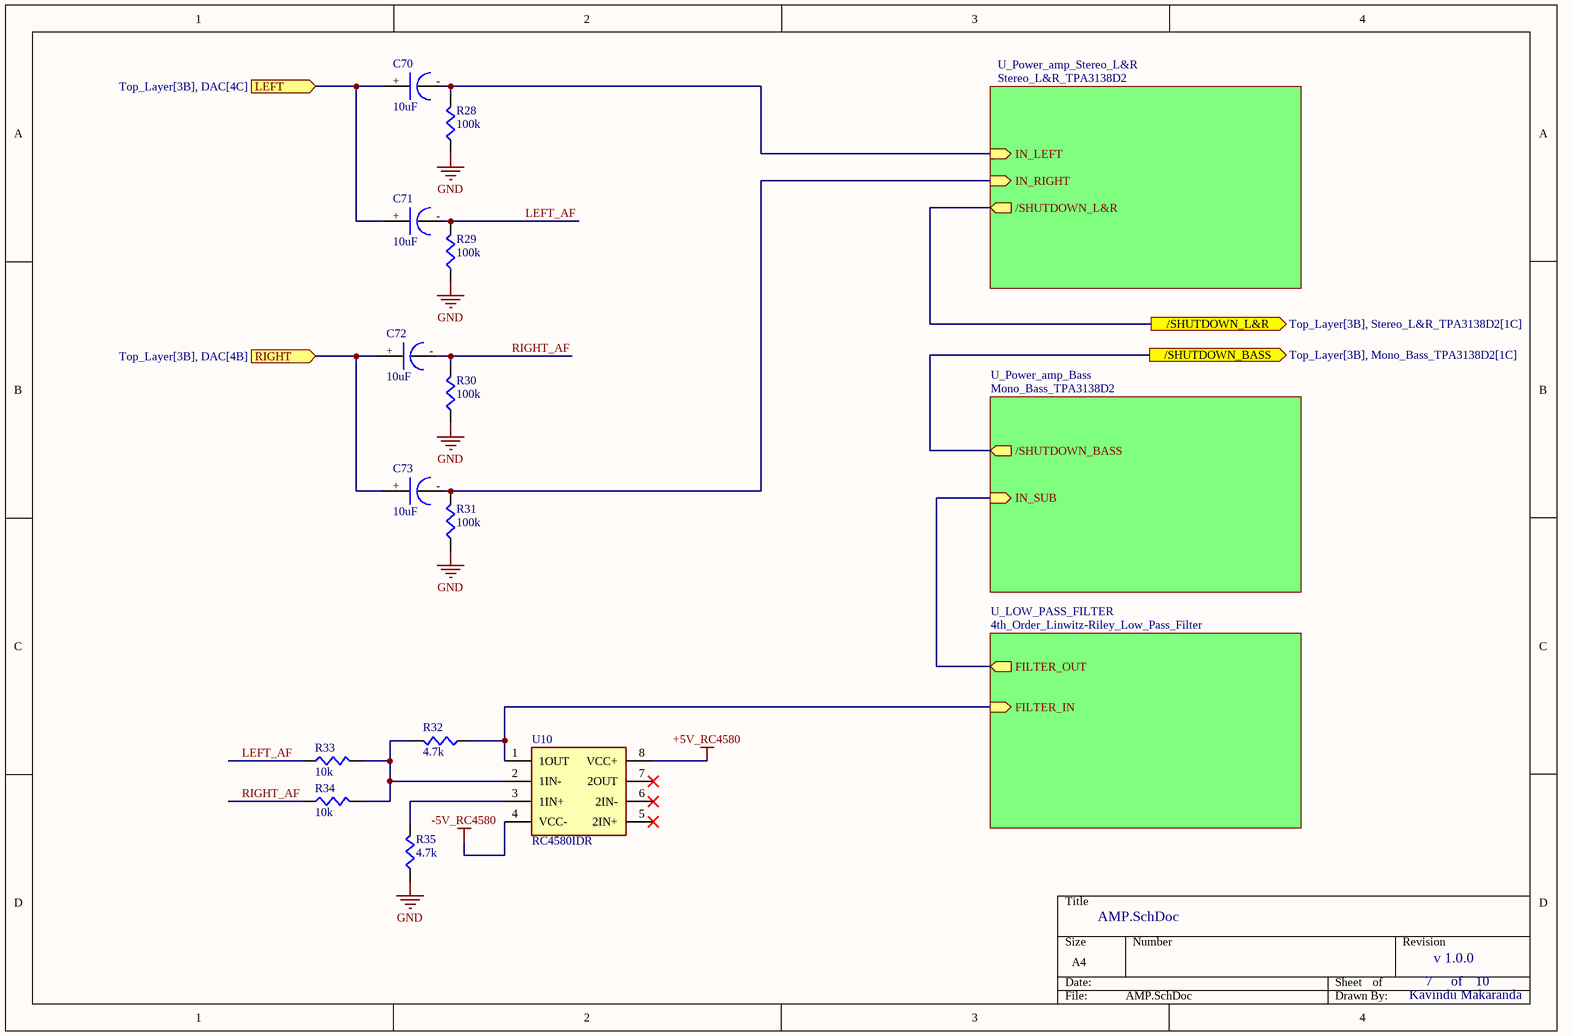
[diagram p5: AMP.SchDoc]

### Parts
C70  10uF  [CAPD6.3XL5.8X61M]
C71  10uF  [CAPD6.3XL5.8X61M]
C72  10uF  [CAPD6.3XL5.8X61M]
C73  10uF  [CAPD6.3XL5.8X61M]
R28  100k  [RECS0603X45N]
R29  100k  [RECS0603X45N]
R30  100k  [RECS0603X45N]
R31  100k  [RECS0603X45N]
R32  4.7k  [RECS0603X45N]
R33  10k  [RECS0603X45N]
R34  10k  [RECS0603X45N]
R35  4.7k  [RECS0603X45N]
U10  RC4580IDR  [SOIC127P600X175-8N]

### Sub-sheets
U_LOW_PASS_FILTER = 4th_Order_Linwitz-Riley_Low_Pass_Filter: FILTER_IN (in), FILTER_OUT (out)
U_Power_amp_Bass = Mono_Bass_TPA3138D2: IN_SUB (in), /SHUTDOWN_BASS (out)
U_Power_amp_Stereo_L&R = Stereo_L&R_TPA3138D2: IN_LEFT (in), IN_RIGHT (in), /SHUTDOWN_L&R (out)

### Ports
/SHUTDOWN_BASS (out, see Top_Layer[3B], Mono_Bass_TPA3138D2[1C]), /SHUTDOWN_L&R (out, see Top_Layer[3B], Stereo_L&R_TPA3138D2[1C]), LEFT (in, see Top_Layer[3B], DAC[4C]), RIGHT (in, see Top_Layer[3B], DAC[4B])

### Nets
+5V_RC4580: U10.8(VCC+)
-5V_RC4580: U10.4(VCC-)
GND: R28.1 R29.1 R30.1 R31.1 R35.1
LEFT_AF: C71.2 R29.2 R33.1
P0.04 / AIN0: port /SHUTDOWN_L&R, sheet U_Power_amp_Stereo_L&R//SHUTDOWN_L&R
P0.05 / AIN1: port /SHUTDOWN_BASS, sheet U_Power_amp_Bass//SHUTDOWN_BASS
RIGHT_AF: C72.2 R30.2 R34.1
NetC22_2: C72.1 C73.1 ; port RIGHT
NetC29_2: C70.1 C71.1 ; port LEFT
NetC67_2: sheet U_Power_amp_Bass/IN_SUB, sheet U_LOW_PASS_FILTER/FILTER_OUT
NetC70_2: C70.2 R28.2 ; sheet U_Power_amp_Stereo_L&R/IN_LEFT
NetC73_2: C73.2 R31.2 ; sheet U_Power_amp_Stereo_L&R/IN_RIGHT
NetR21_1: R32.1 U10.1(1OUT) ; sheet U_LOW_PASS_FILTER/FILTER_IN
NetR32_2: R32.2 R33.2 R34.2 U10.2(1IN-)
NetR35_2: R35.2 U10.3(1IN+)

Not connected (* = marked no-connect by the designer): U10 5(2IN+)* 6(2IN-)* 7(2OUT)*

### Notes on the sheet
- v 1.0.0
- of
- (in symbol CPD6.3XL5.8_10uF_POLYMER) +; -

### Library data of the parts
C70-C73 = CPD6.3XL5.8_10uF_POLYMER: C5246550, HV1V106M0605PZ, -55℃~+105℃ 10uF 2.2mm 2000hrs 35V 5.8mm 6.3mm ±20% SMD,D6.3xL5.8mm Polymer Aluminum Capacitors ROHS; Supplier 1: LCSC; Supplier Part Number 1: C5246550
R28-R31 = RESC0603_100K_THIN: as R4 on sheet LED_Indicator; Supplier 1: element14 APAC; Supplier Part Number 1: AC0603FR-07100KL
R32 R35 = RESC0603_4.7K_THIN: C513565, RT0603BRD074K7L, -55℃~+155℃ 100mW 4.7kΩ 75V Thin Film Resistor ±0.1% ±25ppm/℃ 0603 Chip Resistor - Surface Mount ROHS; Supplier 1: Avnet; Supplier Part Number 1: RT0603BRD074K7L
R33 R34 = RESC0603_10K_THIN: C95204, RT0603BRD0710KL, -55℃~+155℃ 100mW 10kΩ 75V Thin Film Resistor ±0.1% ±25ppm/℃ 0603 Chip Resistor - Surface Mount ROHS; Supplier 1: Avnet; Supplier Part Number 1: RT0603BRD0710KL
U10 = RC4580IDR: C80100, RC4580IDR, -16V~-2V、2V~16V -40℃~+85℃ 0.0005% 110dB 2-Channel 9mA SOIC-8 Audio Amplifiers ROHS; Manufacturer_Name: Texas Instruments; Datasheet Link: http://www.ti.com/lit/gpn/rc4580; Height: 1.75mm; Manufacturer_Part_Number: RC4580IDR; Mouser Part Number: 595-RC4580IDR; Mouser Price/Stock: https://www.mouser.co.uk/ProductDetail/Texas-Instruments/RC4580IDR?qs=sSOk4GDDv7xt5SOlVrtkww%3D%3D; Arrow Part Number: RC4580IDR; Arrow Price/Stock: https://www.arrow.com/en/products/rc4580idr/texas-instruments?region=nac; Supplier 1: Rochester Electronics; Supplier Part Number 1: RC4580IDR

## Sheet Stereo_L&R_TPA3138D2.SchDoc
size A4; SheetNumber: 9; SheetTotal: 10
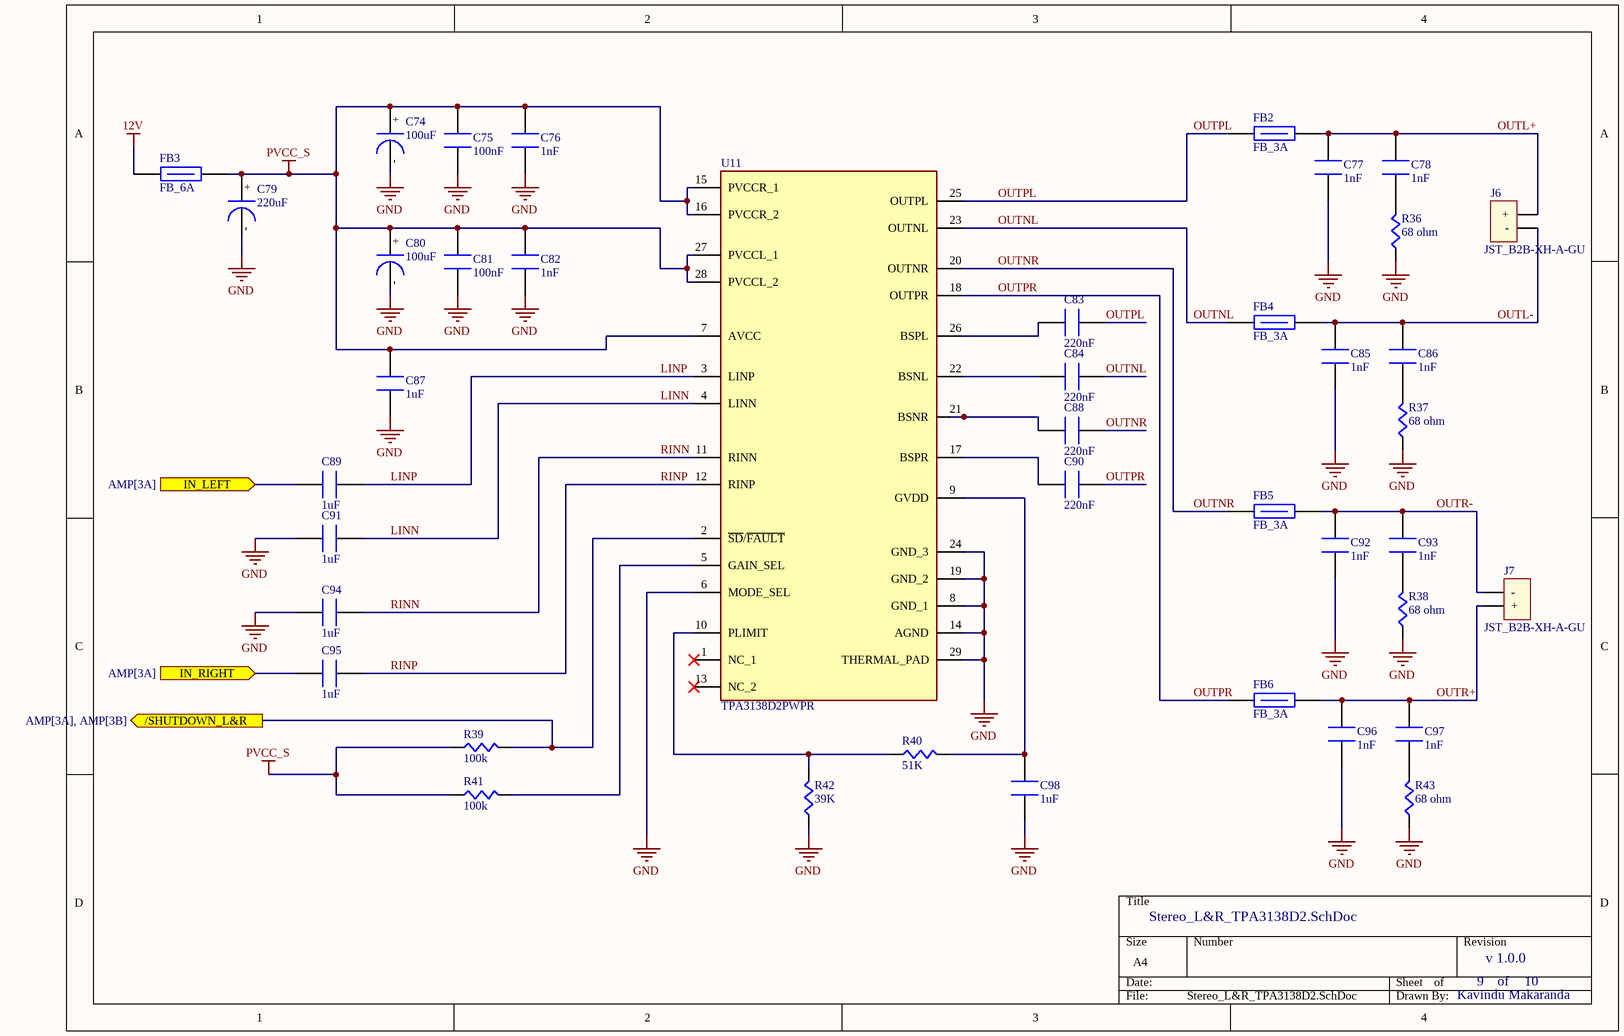
[diagram p6: Stereo_L&R_TPA3138D2.SchDoc]

### Parts
C74  100uF  [CAPD6.3XL6.3X77M]
C75  100nF  [CAPC0603X8N]
C76  1nF  [CAPC0603X8N]
C77  1nF  [CAPC0603X8N]
C78  1nF  [CAPC0603X8N]
C79  220uF  [CAPD6.3XL6.3X77M]
C80  100uF  [CAPD6.3XL6.3X77M]
C81  100nF  [CAPC0603X8N]
C82  1nF  [CAPC0603X8N]
C83  220nF  [CAPC1206X18N]
C84  220nF  [CAPC1206X18N]
C85  1nF  [CAPC0603X8N]
C86  1nF  [CAPC0603X8N]
C87  1uF  [CAP0805X13N]
C88  220nF  [CAPC1206X18N]
C89  1uF  [CAP0805X13N]
C90  220nF  [CAPC1206X18N]
C91  1uF  [CAP0805X13N]
C92  1nF  [CAPC0603X8N]
C93  1nF  [CAPC0603X8N]
C94  1uF  [CAP0805X13N]
C95  1uF  [CAP0805X13N]
C96  1nF  [CAPC0603X8N]
C97  1nF  [CAPC0603X8N]
C98  1uF  [CAP0805X13N]
FB2  FB_3A  [FB0603X08N]
FB3  FB_6A  [FB0805X12N]
FB4  FB_3A  [FB0603X08N]
FB5  FB_3A  [FB0603X08N]
FB6  FB_3A  [FB0603X08N]
J6  JST_B2B-XH-A-GU  [JST_B2B_XH_A_GU]
J7  JST_B2B-XH-A-GU  [JST_B2B_XH_A_GU]
R36  68 ohm  [RECS0603X45N]
R37  68 ohm  [RECS0603X45N]
R38  68 ohm  [RECS0603X45N]
R39  100k  [RECS0603X45N]
R40  51K  [RECS0603X45N]
R41  100k  [RECS0603X45N]
R42  39K  [RECS0603X45N]
R43  68 ohm  [RECS0603X45N]
U11  TPA3138D2PWPR  [SOP65P640X120-29N]

### Ports
/SHUTDOWN_L&R (out, see AMP[3A], AMP[3B]), IN_LEFT (in, see AMP[3A]), IN_RIGHT (in, see AMP[3A])

### Nets
12V: FB3.1
GND: C74.2 C75.1 C76.1 C77.1 C79.2 C80.2 C81.1 C82.1 C85.1 C87.1 C91.1 C92.1 C94.1 C96.1 C98.1 R36.1 R37.1 R38.1 R42.1 R43.1 U11.6(MODE_SEL) U11.8(GND_1) U11.14(AGND) U11.19(GND_2) U11.24(GND_3) U11.29(THERMAL_PAD)
PVCC_S: C74.1 C75.2 C76.2 C79.1 C80.1 C81.2 C82.2 C87.2 FB3.2 R39.1 R41.1 U11.7(AVCC) U11.15(PVCCR_1) U11.16(PVCCR_2) U11.27(PVCCL_1) U11.28(PVCCL_2)
LINN: C91.2 U11.4(LINN)
LINP: C89.2 U11.3(LINP)
OUTL+: C77.2 C78.2 FB2.2 J6.1(+)
OUTL-: C85.2 C86.2 FB4.2 J6.2(-)
OUTNL: C84.2 FB4.1 U11.23(OUTNL)
OUTNR: C88.2 FB5.1 U11.20(OUTNR)
OUTPL: C83.2 FB2.1 U11.25(OUTPL)
OUTPR: C90.2 FB6.1 U11.18(OUTPR)
OUTR+: C96.2 C97.2 FB6.2 J7.1(+)
OUTR-: C92.2 C93.2 FB5.2 J7.2(-)
P0.04 / AIN0: R39.2 U11.2(~{SD}/~{FAULT}) ; port /SHUTDOWN_L&R
RINN: C94.2 U11.11(RINN)
RINP: C95.2 U11.12(RINP)
NetC70_2: C89.1 ; port IN_LEFT
NetC73_2: C95.1 ; port IN_RIGHT
NetC78_1: C78.1 R36.2
NetC83_1: C83.1 U11.26(BSPL)
NetC84_1: C84.1 U11.22(BSNL)
NetC86_1: C86.1 R37.2
NetC88_1: C88.1 U11.21(BSNR)
NetC90_1: C90.1 U11.17(BSPR)
NetC93_1: C93.1 R38.2
NetC97_1: C97.1 R43.2
NetC98_2: C98.2 R40.2 U11.9(GVDD)
NetR40_1: R40.1 R42.2 U11.10(PLIMIT)
NetR41_2: R41.2 U11.5(GAIN_SEL)

Not connected (* = marked no-connect by the designer): U11 1(NC_1)* 13(NC_2)*

### Notes on the sheet
- v 1.0.0
- of
- (in symbol CPD6.3XL7.7_100uF_POLY) +; -
- (in symbol CPD6.3XL7.7_220uF_POLY) +; -

### Library data of the parts
C74 C80 = CPD6.3XL7.7_100uF_POLY: C5246554, HV1V107M0607PZ, -55℃~+105℃ 100uF 2.2mm 2000hrs 35V 6.3mm 7.7mm ±20% SMD,D6.3xL7.7mm Polymer Aluminum Capacitors ROHS; Supplier 1: LCSC; Supplier Part Number 1: C5246554
C75 C81 = CC0603_100nF_X7R: as C50 on sheet Power_Section; Supplier 1: element14 APAC; Supplier Part Number 1: CC0603KRX7R9BB104
C76 C82 = CC0603_1nF_X7R: C100040, CC0603KRX7R9BB102, 1nF 50V X7R ±10% 0603 Multilayer Ceramic Capacitors MLCC - SMD/SMT ROHS; Supplier 1: element14 APAC; Supplier Part Number 1: CC0603KRX7R9BB102
C77 C78 C85 C86 C92 C93 C96 C97 = CC0603_1nF_NPO: C106246, CC0603JRNPO9BN102, 1nF 50V NP0 ±5% 0603 Multilayer Ceramic Capacitors MLCC - SMD/SMT ROHS; Supplier 1: element14 APAC; Supplier Part Number 1: CC0603JRNPO9BN102
C79 = CPD6.3XL7.7_220uF_POLY: C5246541, HV1E227M0607PZ, -55℃~+105℃ 2.2mm 2000hrs 220uF 25V 6.3mm 7.7mm ±20% SMD,D6.3xL7.7mm Polymer Aluminum Capacitors ROHS; Supplier 1: LCSC; Supplier Part Number 1: C5246541
C83 C84 C88 C90 = CC1206_220nF_NPO: C464977, GRM31C5C1H224JE02L, 220nF 50V C0G ±5% 1206 Multilayer Ceramic Capacitors MLCC - SMD/SMT ROHS; Supplier 1: Chip One Stop; Supplier Part Number 1: GRM31C5C1H224JE02L
C87 C89 C91 C94 C95 C98 = CC0805_1uF_X7R: as C58 on sheet Power_Section; Supplier 1: Future Electronics; Supplier Part Number 1: CL21B105KBFNNNE
FB2 FB4-FB6 = FB0603_3A: as FB1 on sheet Power_Section; Supplier 1: element14 APAC; Supplier Part Number 1: MPZ1608S101ATAH0
FB3 = FB0805_6A: C136227, MPZ2012S300AT000, -55℃~+125℃ 1 10mΩ 30Ω@100MHz 6A ±25% 0805 Ferrite Beads ROHS; Supplier 1: element14 APAC; Supplier Part Number 1: MPZ2012S300AT000
J6 J7 = JST_B2B-XH-A-GU: C265283, B2B-XH-A-GU, -25℃~+85℃ 1 1x2P 2 2.5mm 250V 2P 3A 5.75mm 7.4mm 7mm Brass Gold K Pin PA66 Through Hole UL94V-0 White XH 插件,P=2.5mm Wire To Board Connector ROHS; Supplier 1: Verical; Supplier Part Number 1: B2B-XH-A-GU
R36-R38 R43 = RESC0603_68_THIN: C861523, RT0603BRD0768RL, -55℃~+155℃ 100mW 68Ω 75V Thin Film Resistor ±0.1% ±25ppm/℃ 0603 Chip Resistor - Surface Mount ROHS; Supplier 1: CoreStaff; Supplier Part Number 1: ST66570258
R39 R41 = RESC0603_100K_THIN: as R4 on sheet LED_Indicator; Supplier 1: element14 APAC; Supplier Part Number 1: AC0603FR-07100KL
R40 = RESC0603_51K_THICK: C107231, RC0603FR-0751KL, -55℃~+155℃ 100mW 51kΩ 75V Thick Film Resistor ±1% ±100ppm/℃ 0603 Chip Resistor - Surface Mount ROHS; Supplier 1: element14 APAC; Supplier Part Number 1: RC0603FR-0751KL
R42 = RESC0603_39K_THICK: C163424, RC0603FR-0739KL, -55℃~+155℃ 100mW 39kΩ 75V Thick Film Resistor ±1% ±100ppm/℃ 0603 Chip Resistor - Surface Mount ROHS; Supplier 1: element14 APAC; Supplier Part Number 1: RC0603FR-0739KL
U11 = TPA3138D2PWPR: C475506, TPA3138D2PWPR, -10℃~+85℃ -70dB 0.04% 102dB 10W×2@6Ω、18.5W×1@4Ω 2-Channel 20mA 3.5V~14.4V Automatic mute/no-noise switch、Overvoltage protection、Digital programmable gain Class D TSSOP-28-EP Audio Amplifiers ROHS; Manufacturer_Name: Texas Instruments; Datasheet Link: http://www.ti.com/lit/gpn/tpa3138d2; Height: 1.2mm; Manufacturer_Part_Number: TPA3138D2PWPR; Mouser Part Number: 595-TPA3138D2PWPR; Mouser Price/Stock: https://www.mouser.co.uk/ProductDetail/Texas-Instruments/TPA3138D2PWPR?qs=fAHHVMwC%252BbipgX0F9%252BCw8A%3D%3D; Arrow Part Number: TPA3138D2PWPR; Arrow Price/Stock: null?region=nac; Supplier 1: DigiKey; Supplier Part Number 1: 296-51849-1-ND

## Sheet Mono_Bass_TPA3138D2.SchDoc
size A4; SheetNumber: 10; SheetTotal: 10
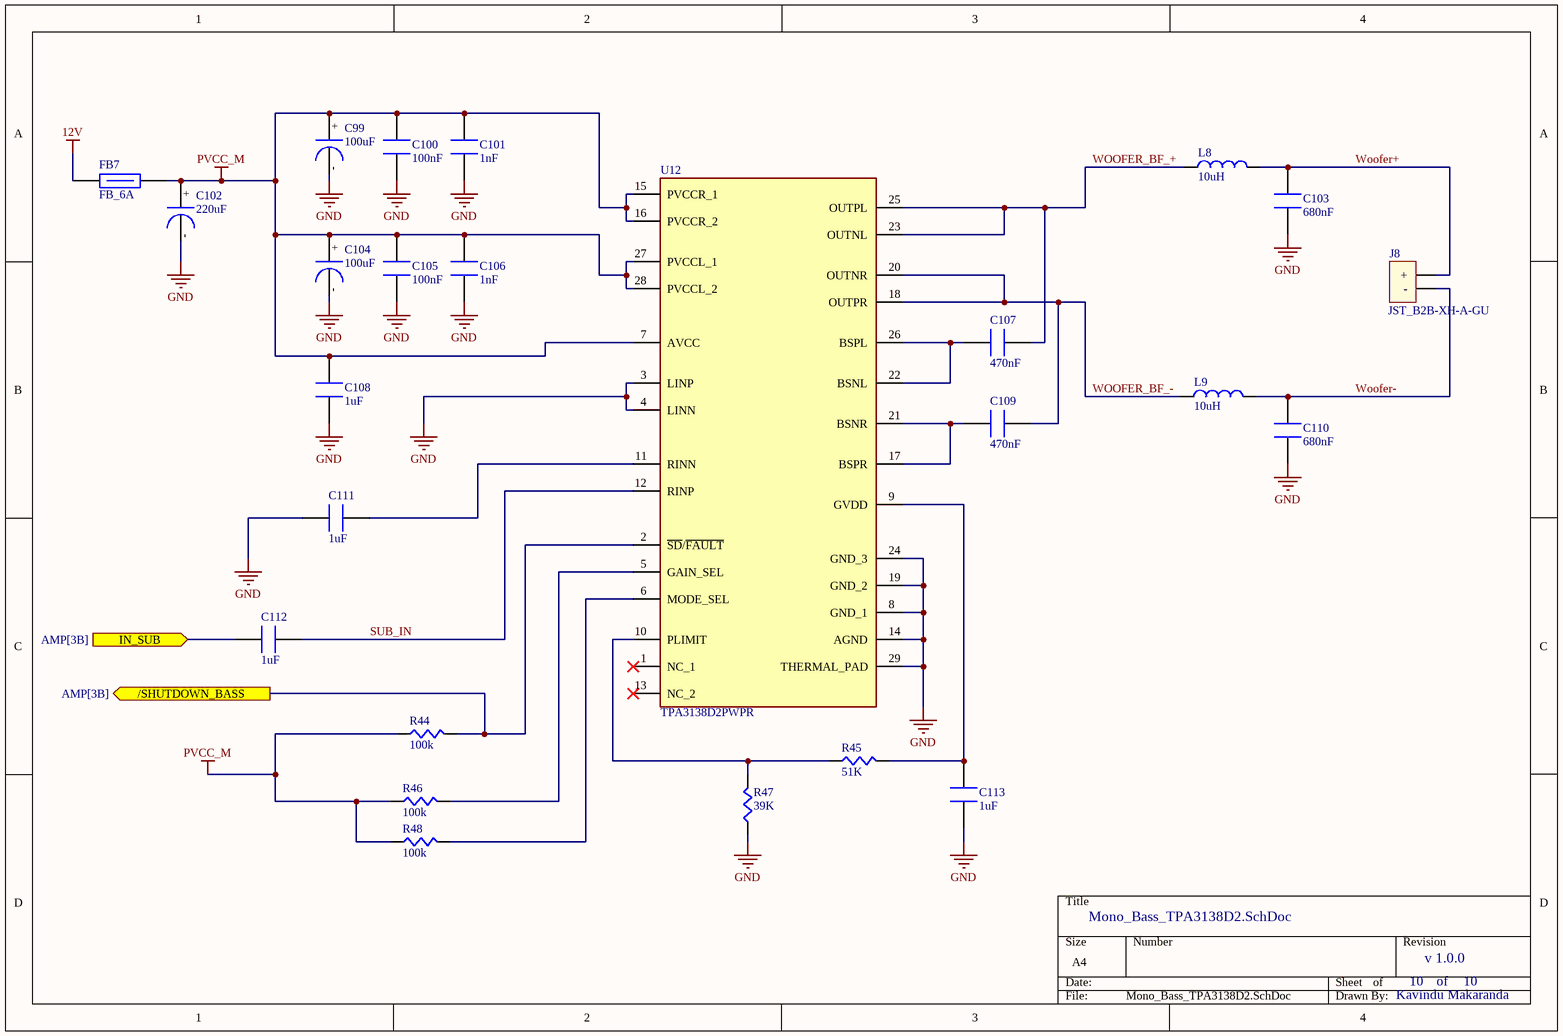
[diagram p7: Mono_Bass_TPA3138D2.SchDoc]

### Parts
C99  100uF  [CAPD6.3XL6.3X77M]
C100  100nF  [CAPC0603X8N]
C101  1nF  [CAPC0603X8N]
C102  220uF  [CAPD6.3XL6.3X77M]
C103  680nF  [CAPC1206X18N]
C104  100uF  [CAPD6.3XL6.3X77M]
C105  100nF  [CAPC0603X8N]
C106  1nF  [CAPC0603X8N]
C107  470nF  [CAPC1206X18N]
C108  1uF  [CAP0805X13N]
C109  470nF  [CAPC1206X18N]
C110  680nF  [CAPC1206X18N]
C111  1uF  [CAP0805X13N]
C112  1uF  [CAP0805X13N]
C113  1uF  [CAP0805X13N]
FB7  FB_6A  [FB0805X12N]
J8  JST_B2B-XH-A-GU  [JST_B2B_XH_A_GU]
L8  10uH  [INDC6060X45N]
L9  10uH  [INDC6060X45N]
R44  100k  [RECS0603X45N]
R45  51K  [RECS0603X45N]
R46  100k  [RECS0603X45N]
R47  39K  [RECS0603X45N]
R48  100k  [RECS0603X45N]
U12  TPA3138D2PWPR  [SOP65P640X120-29N]

### Ports
/SHUTDOWN_BASS (out, see AMP[3B]), IN_SUB (in, see AMP[3B])

### Nets
12V: FB7.1
GND: C99.2 C100.1 C101.1 C102.2 C103.1 C104.2 C105.1 C106.1 C108.1 C110.1 C111.1 C113.1 R47.1 U12.3(LINP) U12.4(LINN) U12.8(GND_1) U12.14(AGND) U12.19(GND_2) U12.24(GND_3) U12.29(THERMAL_PAD)
PVCC_M: C99.1 C100.2 C101.2 C102.1 C104.1 C105.2 C106.2 C108.2 FB7.2 R44.1 R46.1 R48.1 U12.7(AVCC) U12.15(PVCCR_1) U12.16(PVCCR_2) U12.27(PVCCL_1) U12.28(PVCCL_2)
P0.05 / AIN1: R44.2 U12.2(~{SD}/~{FAULT}) ; port /SHUTDOWN_BASS
SUB_IN: C112.2 U12.12(RINP)
Woofer+: C103.2 J8.1(+) L8.2
Woofer-: C110.2 J8.2(-) L9.2
WOOFER_BF_+: C107.2 L8.1 U12.23(OUTNL) U12.25(OUTPL)
WOOFER_BF_-: C109.2 L9.1 U12.18(OUTPR) U12.20(OUTNR)
NetC67_2: C112.1 ; port IN_SUB
NetC107_1: C107.1 U12.22(BSNL) U12.26(BSPL)
NetC109_1: C109.1 U12.17(BSPR) U12.21(BSNR)
NetC111_2: C111.2 U12.11(RINN)
NetC113_2: C113.2 R45.2 U12.9(GVDD)
NetR45_1: R45.1 R47.2 U12.10(PLIMIT)
NetR46_2: R46.2 U12.5(GAIN_SEL)
NetR48_2: R48.2 U12.6(MODE_SEL)

Not connected (* = marked no-connect by the designer): U12 1(NC_1)* 13(NC_2)*

### Notes on the sheet
- v 1.0.0
- of
- (in symbol CPD6.3XL7.7_100uF_POLY) +; -
- (in symbol CPD6.3XL7.7_220uF_POLY) +; -

### Library data of the parts
C99 C104 = CPD6.3XL7.7_100uF_POLY: as C74 on sheet Stereo_L&R_TPA3138D2; Supplier 1: LCSC; Supplier Part Number 1: C5246554
C100 C105 = CC0603_100nF_X7R: as C50 on sheet Power_Section; Supplier 1: element14 APAC; Supplier Part Number 1: CC0603KRX7R9BB104
C101 C106 = CC0603_1nF_X7R: as C76 on sheet Stereo_L&R_TPA3138D2; Supplier 1: element14 APAC; Supplier Part Number 1: CC0603KRX7R9BB102
C102 = CPD6.3XL7.7_220uF_POLY: as C79 on sheet Stereo_L&R_TPA3138D2; Supplier 1: LCSC; Supplier Part Number 1: C5246541
C103 C110 = CC1206_680nF_X7R: C145012, CC1206KKX7R9BB684, 50V 680nF X7R ±10% 1206 Multilayer Ceramic Capacitors MLCC - SMD/SMT ROHS; Supplier 1: element14 APAC; Supplier Part Number 1: CC1206KKX7R9BB684
C107 C109 = CC1206_470nF_X7R: C277483, CC1206KKX7R9BB474, 470nF 50V X7R ±10% 1206 Multilayer Ceramic Capacitors MLCC - SMD/SMT ROHS; Supplier 1: element14 APAC; Supplier Part Number 1: CC1206KKX7R9BB474
C108 C111-C113 = CC0805_1uF_X7R: as C58 on sheet Power_Section; Supplier 1: Future Electronics; Supplier Part Number 1: CL21B105KBFNNNE
FB7 = FB0805_6A: as FB3 on sheet Stereo_L&R_TPA3138D2; Supplier 1: element14 APAC; Supplier Part Number 1: MPZ2012S300AT000
J8 = JST_B2B-XH-A-GU: as J6 on sheet Stereo_L&R_TPA3138D2; Supplier 1: Verical; Supplier Part Number 1: B2B-XH-A-GU
L8 L9 = IN0606_10uH_2.7A: C168076, FNR6045S100MT, 10uH 2.7A 3.5A 62mΩ Magnetic Shielded Inductor ±20% SMD,6x6mm Power Inductors ROHS
R44 R46 R48 = RESC0603_100K_THIN: as R4 on sheet LED_Indicator; Supplier 1: element14 APAC; Supplier Part Number 1: AC0603FR-07100KL
R45 = RESC0603_51K_THICK: as R40 on sheet Stereo_L&R_TPA3138D2; Supplier 1: element14 APAC; Supplier Part Number 1: RC0603FR-0751KL
R47 = RESC0603_39K_THICK: as R42 on sheet Stereo_L&R_TPA3138D2; Supplier 1: element14 APAC; Supplier Part Number 1: RC0603FR-0739KL
U12 = TPA3138D2PWPR: as U11 on sheet Stereo_L&R_TPA3138D2; Datasheet Link: http://www.ti.com/lit/gpn/tpa3138d2; Height: 1.2mm; Manufacturer_Part_Number: TPA3138D2PWPR; Mouser Part Number: 595-TPA3138D2PWPR; Mouser Price/Stock: https://www.mouser.co.uk/ProductDetail/Texas-Instruments/TPA3138D2PWPR?qs=fAHHVMwC%252BbipgX0F9%252BCw8A%3D%3D; Arrow Part Number: TPA3138D2PWPR; Arrow Price/Stock: null?region=nac; Supplier 1: DigiKey; Supplier Part Number 1: 296-51849-1-ND

## Sheet 4th_Order_Linwitz-Riley_Low_Pass_Filter.SchDoc
size A4; SheetNumber: 8; SheetTotal: 10
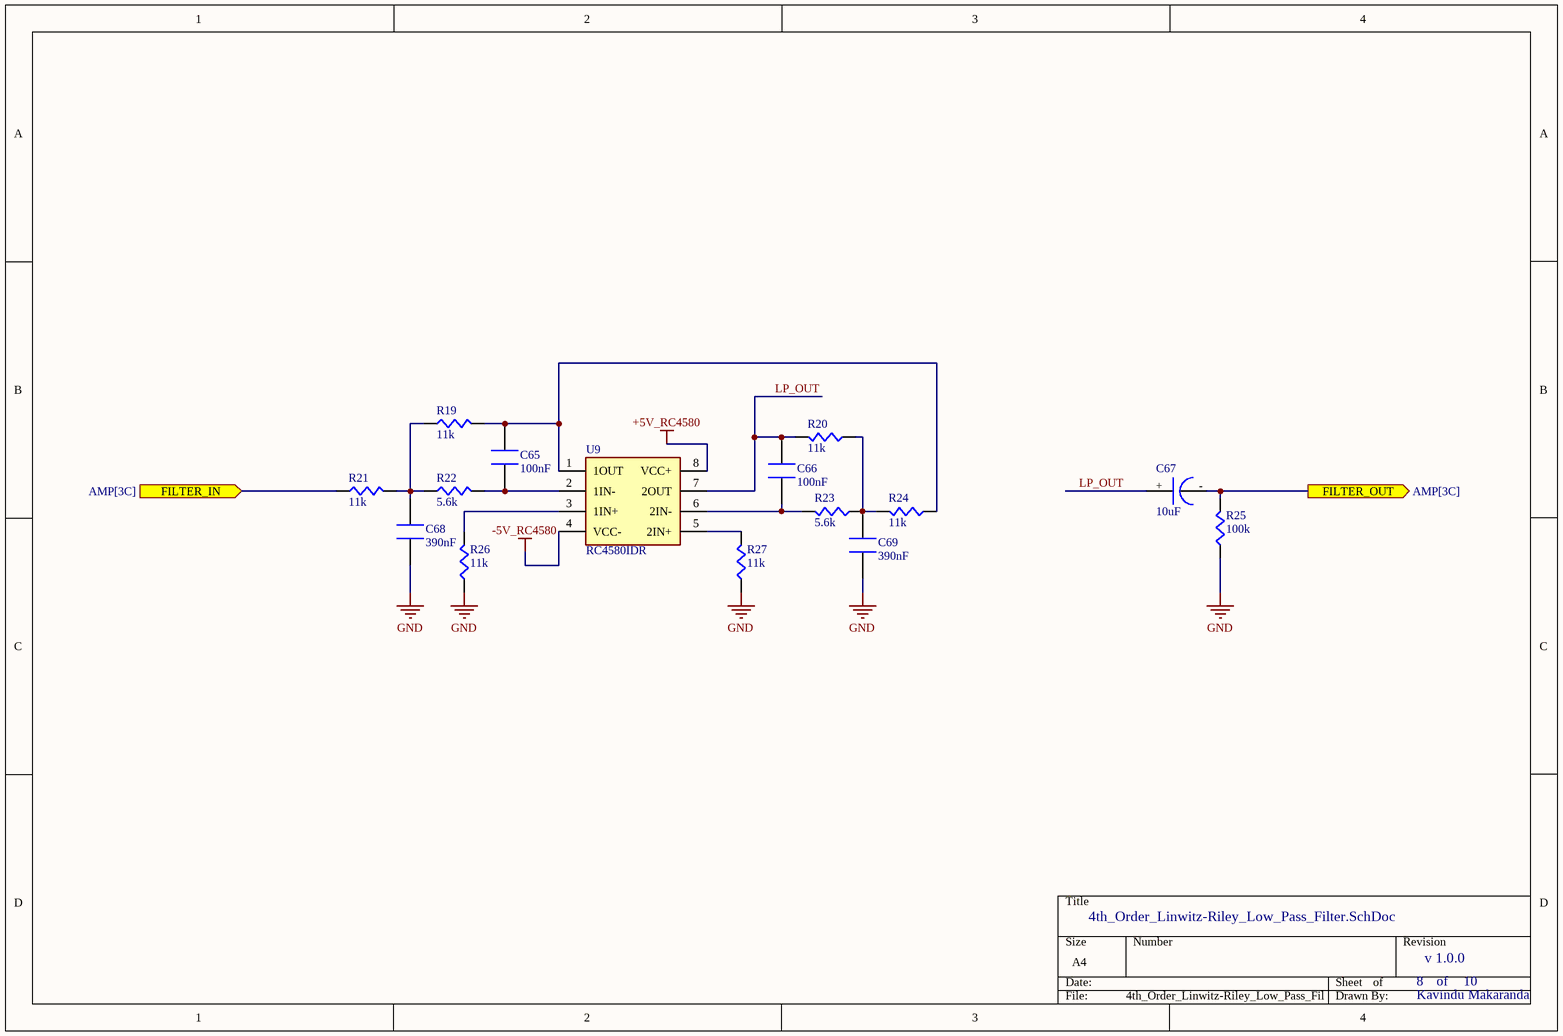
[diagram p8: 4th_Order_Linwitz-Riley_Low_Pass_Filter.SchDoc]

### Parts
C65  100nF  [CAPC1206X18N]
C66  100nF  [CAPC1206X18N]
C67  10uF  [CAPD6.3XL5.8X61M]
C68  390nF  [CAPC0805X14N]
C69  390nF  [CAPC0805X14N]
R19  11k  [RECS0603X45N]
R20  11k  [RECS0603X45N]
R21  11k  [RECS0603X45N]
R22  5.6k  [RECS0603X45N]
R23  5.6k  [RECS0603X45N]
R24  11k  [RECS0603X45N]
R25  100k  [RECS0603X45N]
R26  11k  [RECS0603X45N]
R27  11k  [RECS0603X45N]
U9  RC4580IDR  [SOIC127P600X175-8N]

### Ports
FILTER_IN (in, see AMP[3C]), FILTER_OUT (out, see AMP[3C])

### Nets
+5V_RC4580: U9.8(VCC+)
-5V_RC4580: U9.4(VCC-)
GND: C68.1 C69.2 R25.1 R26.1 R27.1
LP_OUT: C66.1 C67.1 R20.2 U9.7(2OUT)
NetC65_1: C65.1 R22.2 U9.2(1IN-)
NetC65_2: C65.2 R19.2 R24.1 U9.1(1OUT)
NetC66_2: C66.2 R23.2 U9.6(2IN-)
NetC67_2: C67.2 R25.2 ; port FILTER_OUT
NetC68_2: C68.2 R19.1 R21.2 R22.1
NetC69_1: C69.1 R20.1 R23.1 R24.2
NetR21_1: R21.1 ; port FILTER_IN
NetR26_2: R26.2 U9.3(1IN+)
NetR27_2: R27.2 U9.5(2IN+)

### Notes on the sheet
- v 1.0.0
- of
- (in symbol CPD6.3XL5.8_10uF_POLYMER) +; -

### Library data of the parts
C65 C66 = CC1206_100nF_C0G: C97946, GRM31C5C1H104JA01L, 100nF 50V C0G ±5% 1206 Multilayer Ceramic Capacitors MLCC - SMD/SMT ROHS; Supplier 1: TME; Supplier Part Number 1: GRM31C5C1H104JA01L
C67 = CPD6.3XL5.8_10uF_POLYMER: as C70 on sheet AMP; Supplier 1: LCSC; Supplier Part Number 1: C5246550
C68 C69 = CC0805_390nF_X7R: C1854267, CC0805KKX7R9BB394, 390nF 50V X7R ±10% 0805 Multilayer Ceramic Capacitors MLCC - SMD/SMT ROHS; Supplier 1: element14 APAC; Supplier Part Number 1: CC0805KKX7R9BB394
R19-R21 R24 R26 R27 = RESC0603_11K_THIN: C728581, RT0603BRD0711KL, -55℃~+155℃ 100mW 11kΩ 75V Thin Film Resistor ±0.1% ±25ppm/℃ 0603 Chip Resistor - Surface Mount ROHS; Supplier 1: element14 APAC; Supplier Part Number 1: 4152637
R22 R23 = RESC0603_5.6K_THIN: C179095, RT0603BRD075K6L, -55℃~+155℃ 100mW 5.6kΩ 75V Thin Film Resistor ±0.1% ±25ppm/℃ 0603 Chip Resistor - Surface Mount ROHS; Supplier 1: element14 APAC; Supplier Part Number 1: 3496658
R25 = RESC0603_100K_THIN: as R4 on sheet LED_Indicator; Supplier 1: element14 APAC; Supplier Part Number 1: AC0603FR-07100KL
U9 = RC4580IDR: as U10 on sheet AMP; Datasheet Link: http://www.ti.com/lit/gpn/rc4580; Height: 1.75mm; Manufacturer_Part_Number: RC4580IDR; Mouser Part Number: 595-RC4580IDR; Mouser Price/Stock: https://www.mouser.co.uk/ProductDetail/Texas-Instruments/RC4580IDR?qs=sSOk4GDDv7xt5SOlVrtkww%3D%3D; Arrow Part Number: RC4580IDR; Arrow Price/Stock: https://www.arrow.com/en/products/rc4580idr/texas-instruments?region=nac; Supplier 1: Rochester Electronics; Supplier Part Number 1: RC4580IDR

## Sheet DAC.SchDoc
size A4; SheetNumber: 4; SheetTotal: 10
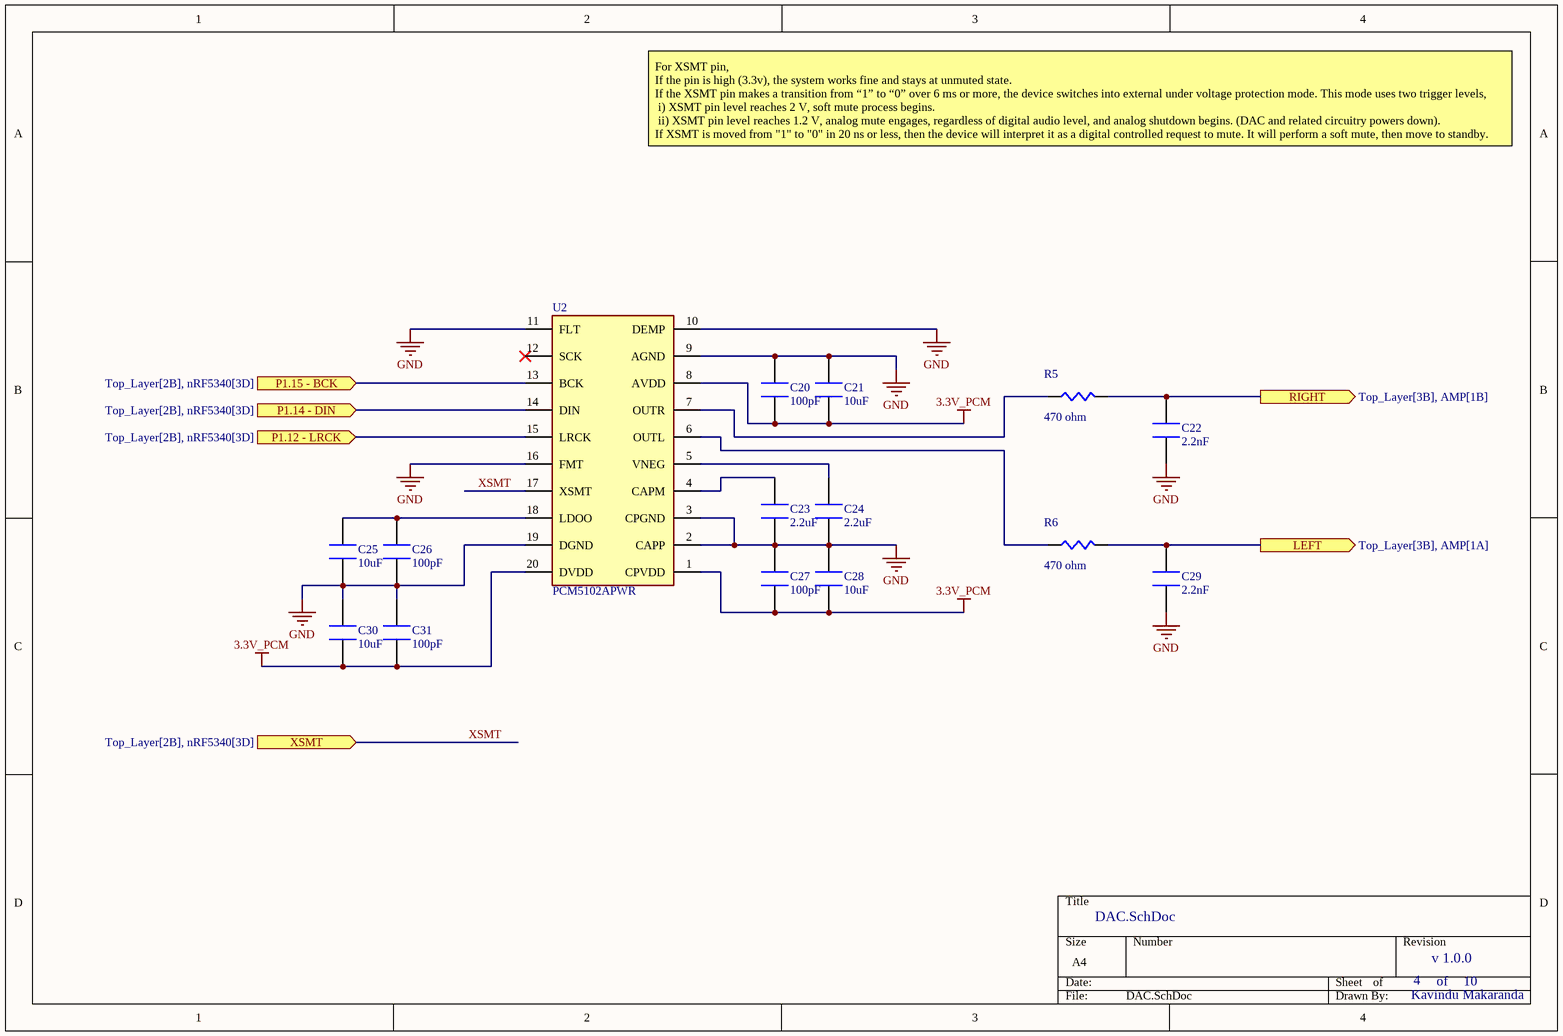
[diagram p9: DAC.SchDoc]

### Parts
C20  100pF  [CAPC0603X8N]
C21  10uF  [CAPC0805X14N]
C22  2.2nF  [CAPC0603X8N]
C23  2.2uF  [CAP0805X13N]
C24  2.2uF  [CAP0805X13N]
C25  10uF  [CAPC0805X14N]
C26  100pF  [CAPC0603X8N]
C27  100pF  [CAPC0603X8N]
C28  10uF  [CAPC0805X14N]
C29  2.2nF  [CAPC0603X8N]
C30  10uF  [CAPC0805X14N]
C31  100pF  [CAPC0603X8N]
R5  470 ohm  [RECS0603X45N]
R6  470 ohm  [RECS0603X45N]
U2  PCM5102APWR  [SOP65P640X120-20N]

### Ports
LEFT (out, see Top_Layer[3B], AMP[1A]), P1.12 - LRCK (in, see Top_Layer[2B], nRF5340[3D]), P1.14 - DIN (in, see Top_Layer[2B], nRF5340[3D]), P1.15 - BCK (in, see Top_Layer[2B], nRF5340[3D]), RIGHT (out, see Top_Layer[3B], AMP[1B]), XSMT (in, see Top_Layer[2B], nRF5340[3D])

### Nets
3.3V_PCM: C20.1 C21.1 C27.1 C28.1 C30.1 C31.1 U2.1(CPVDD) U2.8(AVDD) U2.20(DVDD)
GND: C20.2 C21.2 C22.1 C23.1 C24.1 C25.1 C26.1 C27.2 C28.2 C29.1 C30.2 C31.2 U2.2(CAPP) U2.3(CPGND) U2.9(AGND) U2.10(DEMP) U2.11(FLT) U2.16(FMT) U2.19(DGND)
P0.00 / XL1: U2.15(LRCK) ; port P1.12 - LRCK
P0.01 / XL2: U2.13(BCK) ; port P1.15 - BCK
P1.01: U2.14(DIN) ; port P1.14 - DIN
XSMT: U2.17(XSMT) ; port XSMT  [project net P1.00]
NetC22_2: C22.2 R5.2 ; port RIGHT
NetC23_2: C23.2 U2.4(CAPM)
NetC24_2: C24.2 U2.5(VNEG)
NetC25_2: C25.2 C26.2 U2.18(LDOO)
NetC29_2: C29.2 R6.2 ; port LEFT
NetR5_1: R5.1 U2.7(OUTR)
NetR6_1: R6.1 U2.6(OUTL)

Not connected (* = marked no-connect by the designer): U2 12(SCK)*

### Notes on the sheet
- For XSMT pin,
  If the pin is high (3.3v), the system works fine and stays at unmuted state.
  If the XSMT pin makes a transition from “1” to “0” over 6 ms or more, the device switches into external under voltage protection mode. This mode uses two trigger levels,
  i) XSMT pin level reaches 2 V, soft mute process begins.
  ii) XSMT pin level reaches 1.2 V, analog mute engages, regardless of digital audio level, and analog shutdown begins. (DAC and related circuitry powers down).
  If XSMT is moved from "1" to "0" in 20 ns or less, then the device will interpret it as a digital controlled request to mute. It will perform a soft mute, then move to standby.
- v 1.0.0
- of

### Library data of the parts
C20 C26 C27 C31 = CC0603_100pF_X7R: C14663 ,CC0603KRX7R9BB104, 100nF 50V X7R ±10% 0603 Multilayer Ceramic Capacitors MLCC - SMD/SMT ROHS; Supplier 1: Avnet; Supplier Part Number 1: CC0603KRX7R9BB104
C21 C25 C28 C30 = CC0805_10uF_X7R: as C53 on sheet Power_Section; Supplier 1: Avnet; Supplier Part Number 1: CL21B106KOQNNNE
C22 C29 = CC0603_2.2nF_NPO: C107043, CC0603JRNPO9BN222, 2.2nF 50V NP0 ±5% 0603 Multilayer Ceramic Capacitors MLCC - SMD/SMT ROHS; Supplier 1: Arrow Electronics; Supplier Part Number 1: CC0603JRNPO9BN222
C23 C24 = CC0805_2.2uF_X7R: C19110 ,CL21B225KAFNNNE, 2.2uF 25V X7R ±10% 0805 Multilayer Ceramic Capacitors MLCC - SMD/SMT ROHS; Supplier 1: Avnet; Supplier Part Number 1: CL21B225KAFNNNE
R5 R6 = RESC0603_470_THIN: C705857,RT0603BRE07470RL, -55℃~+155℃ 100mW 470Ω 75V Thin Film Resistor ±0.1% ±50ppm/℃ 0603 Chip Resistor - Surface Mount ROHS; Supplier 1: Arrow Electronics; Supplier Part Number 1: RT0603BRE07470RL
U2 = PCM5102APWR: C107671, PCM5102APWR, -25℃~+85℃ 1.8V~3.3V 2 32 384kHz 500uA 50MHz Audio Decoder I2S TSSOP-20 ADCs/DACs - Special Purpose ROHS; Manufacturer_Name: Texas Instruments; Datasheet Link: https://componentsearchengine.com/Datasheets/2/PCM5102APWR.pdf; Height: 1.2mm; Manufacturer_Part_Number: PCM5102APWR; Mouser Part Number: 595-PCM5102APWR; Mouser Price/Stock: https://www.mouser.co.uk/ProductDetail/Texas-Instruments/PCM5102APWR?qs=E2%2FxqS9xjzrfECkwEYoiyg%3D%3D; Arrow Part Number: PCM5102APWR; Arrow Price/Stock: https://www.arrow.com/en/products/pcm5102apwr/texas-instruments?utm_currency=USD&region=nac; Supplier 1: DigiKey; Supplier Part Number 1: 296-36707-1-ND